# Altium project EXP_V100.PrjPcb
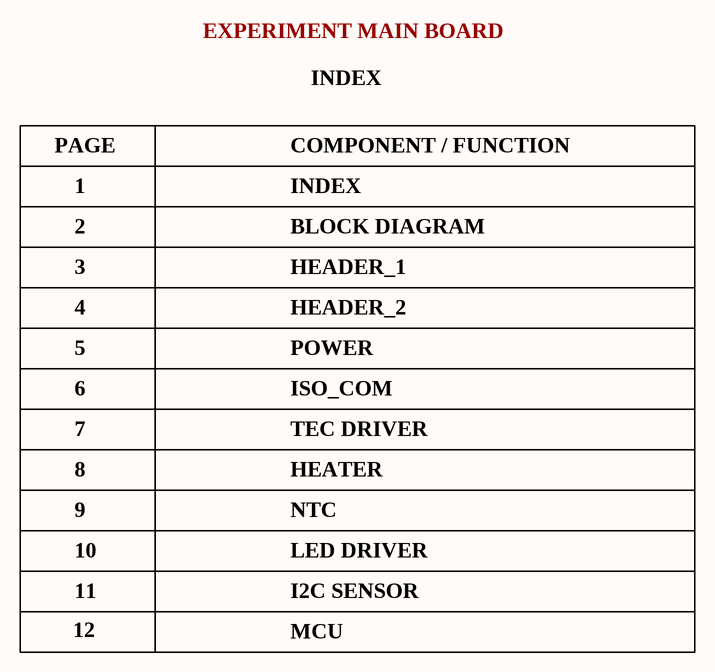
[diagram p0: INDEX.SchDoc]
12 sheets, 357 parts. Net scope: global (net labels, ports and power ports of the same name join across sheets).
Board file: EXP_V101.PcbDoc
Sheets:
  INDEX.SchDoc
  BLOCK_DIAGRAM.SchDoc
  HEADERS_1.SchDoc
  HEADERS_2.SchDoc
  POWERchDoc.SchDoc
  ISO_COM.SchDoc
  TECS_DRIVER.SchDoc
  HEATER.SchDoc
  NTC.SchDoc
  I2C_SENSOR.SchDoc
  LED.SchDoc
  MCU.SchDoc

## Sheet INDEX.SchDoc: INDEX
size 420 x 297 mm; CheckedBy: BAO BUI Q.; Author: SANG HUYNH; DocumentNumber: 1; Revision: V1.0.0; SheetNumber: 2; SheetTotal: 12

### Notes on the sheet
- EXPERIMENT MAIN BOARD
- PAGE
- COMPONENT / FUNCTION
- INDEX
- 1
- 2
- 3
- BLOCK DIAGRAM
- HEADER_1
- 4
- HEADER_2
- 5
- 6
- POWER
- ISO_COM
- 7
- 8
- TEC DRIVER
- HEATER
- 9
- 10
- NTC
- LED DRIVER
- 11
- I2C SENSOR
- 12
- MCU
- Project:
- PEE-PC1
- Sub-system:
- NANORACK_EXP_CONTROLLER
- Design by:
- SANG HUYNH
- BAO BUI Q.
- Sheet title:
- Sheet
- A3
- of
- Checked by:
- Approved by:
- VU PHAM
- Revision:
- Document No:
- V1.0.0
- Size:
- Date:

## Sheet BLOCK_DIAGRAM.SchDoc: BLOCK_DIAGRAM
size 420 x 297 mm; SheetNumber: 2; SheetTotal: 12

### Notes on the sheet
- Project:
- PEE-PC1
- Sub-system:
- NANORACK_EXP_CONTROLLER
- Design by:
- SANG HUYNH
- BAO BUI Q.
- Sheet title:
- Sheet
- A3
- of
- Checked by:
- Approved by:
- VU PHAM
- Revision:
- Document No:
- V1.0.0
- Size:
- Date:
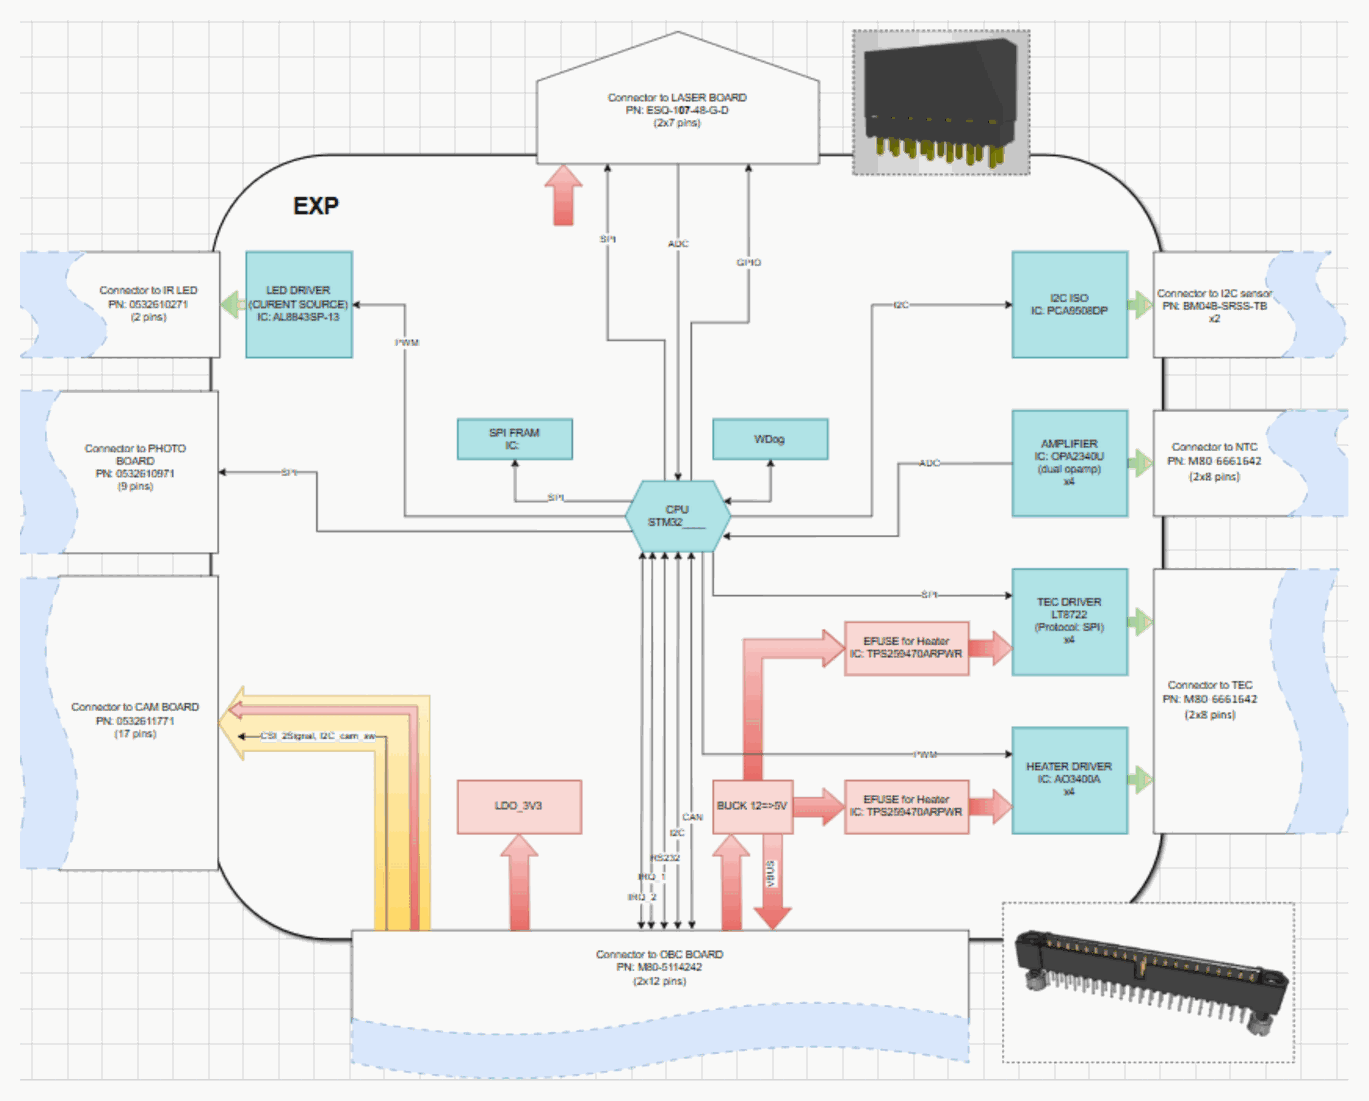
[diagram p1: BLOCK_DIAGRAM.SchDoc]

## Sheet HEADERS_1.SchDoc: HEADER
size 420 x 297 mm; SheetNumber: 3; SheetTotal: 12
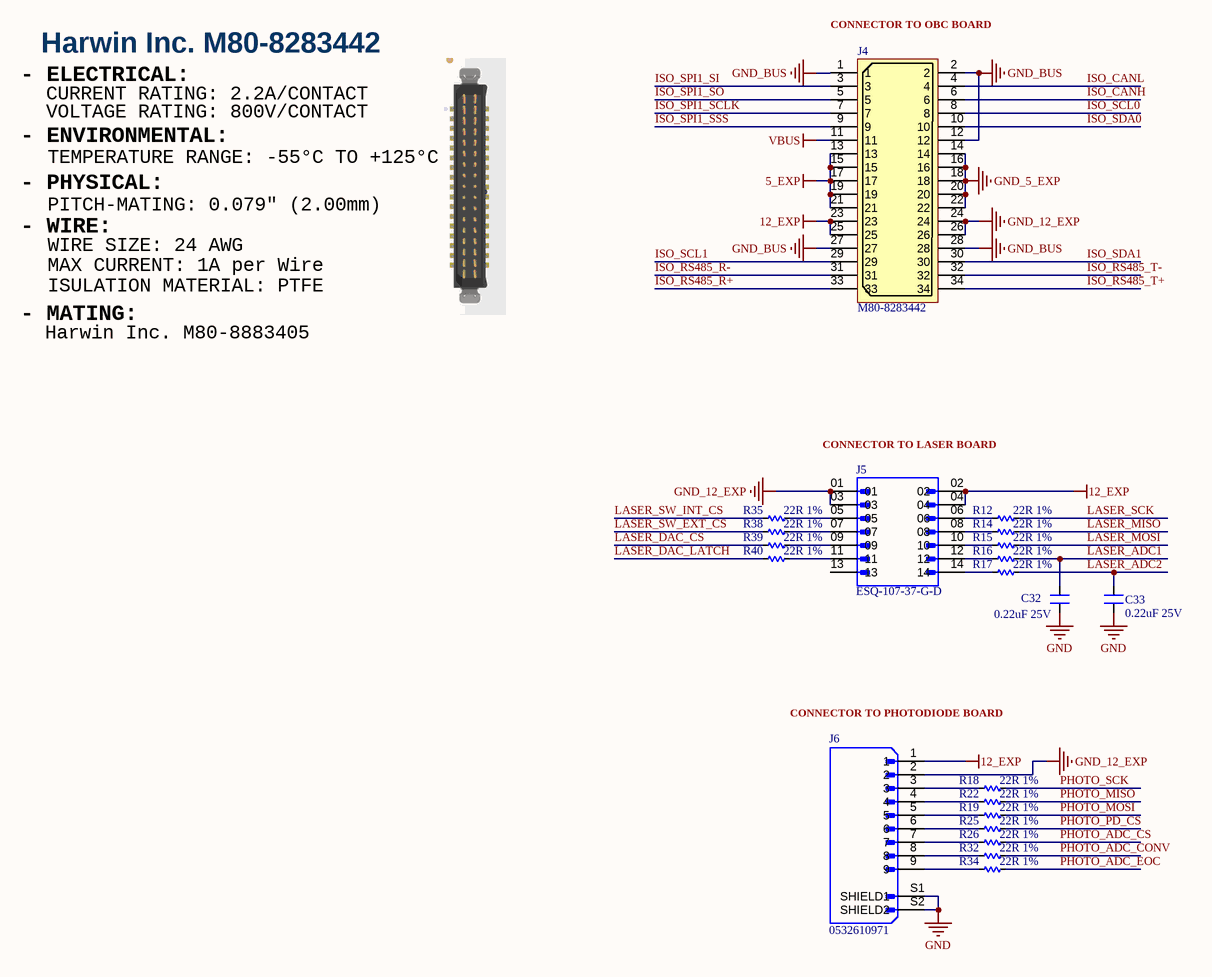
[diagram p2: HEADERS_1.SchDoc]

### Parts
C32  0.22uF 25V  [CN-SMD-0603-EXP-V101]
C33  0.22uF 25V  [CN-SMD-0603-EXP-V101]
J4  M80-8283442  [M80-8283442]
J5  ESQ-107-37-G-D  [ESQ-107-37-G-D]
J6  0532610971  [0532610971]
R12  22R 1%  [RES-SMD-0603-EXP-V101]
R14  22R 1%  [RES-SMD-0603-EXP-V101]
R15  22R 1%  [RES-SMD-0603-EXP-V101]
R16  22R 1%  [RES-SMD-0603-EXP-V101]
R17  22R 1%  [RES-SMD-0603-EXP-V101]
R18  22R 1%  [RES-SMD-0603-EXP-V101]
R19  22R 1%  [RES-SMD-0603-EXP-V101]
R22  22R 1%  [RES-SMD-0603-EXP-V101]
R25  22R 1%  [RES-SMD-0603-EXP-V101]
R26  22R 1%  [RES-SMD-0603-EXP-V101]
R32  22R 1%  [RES-SMD-0603-EXP-V101]
R34  22R 1%  [RES-SMD-0603-EXP-V101]
R35  22R 1%  [RES-SMD-0603-EXP-V101]
R38  22R 1%  [RES-SMD-0603-EXP-V101]
R39  22R 1%  [RES-SMD-0603-EXP-V101]
R40  22R 1%  [RES-SMD-0603-EXP-V101]

### Nets
5_EXP: J4.13 J4.15 J4.17 J4.19 J4.21
12_EXP: J4.23 J4.25 J5.02 J5.04 J6.1
GND: C32.1 C33.1 J4.24 J4.26 J5.01 J5.03 J6.2 J6.S1(SHIELD1) J6.S2(SHIELD2)  [also labelled GND_12_EXP]
GND_5_EXP: J4.14 J4.16 J4.18 J4.20 J4.22
GND_BUS: J4.1 J4.2 J4.12 J4.27 J4.28
VBUS: J4.11
ISO_CANH: J4.6
ISO_CANL: J4.4
ISO_RS485_R+: J4.33
ISO_RS485_R-: J4.31
ISO_RS485_T+: J4.34
ISO_RS485_T-: J4.32
ISO_SCL0: J4.8
ISO_SCL1: J4.29
ISO_SDA0: J4.10
ISO_SDA1: J4.30
ISO_SPI1_~{SSS}: J4.9
ISO_SPI1_SCLK: J4.7
ISO_SPI1_SI: J4.3
ISO_SPI1_SO: J4.5
LASER_ADC1: C32.2 R16.2
LASER_ADC2: C33.2 R17.2
LASER_DAC_CS: R39.1
LASER_DAC_LATCH: R40.1
LASER_MISO: R14.2
LASER_MOSI: R15.2
LASER_SCK: R12.2
LASER_SW_EXT_CS: R38.1
LASER_SW_INT_CS: R35.1
PHOTO_ADC_CONV: R32.2
PHOTO_ADC_CS: R26.2
PHOTO_ADC_EOC: R34.2
PHOTO_MISO: R22.2
PHOTO_MOSI: R19.2
PHOTO_PD_CS: R25.2
PHOTO_SCK: R18.2
NetJ5_05: J5.05 R35.2
NetJ5_06: J5.06 R12.1
NetJ5_07: J5.07 R38.2
NetJ5_08: J5.08 R14.1
NetJ5_09: J5.09 R39.2
NetJ5_10: J5.10 R15.1
NetJ5_11: J5.11 R40.2
NetJ5_12: J5.12 R16.1
NetJ5_14: J5.14 R17.1
NetJ6_3: J6.3 R18.1
NetJ6_4: J6.4 R22.1
NetJ6_5: J6.5 R19.1
NetJ6_6: J6.6 R25.1
NetJ6_7: J6.7 R26.1
NetJ6_8: J6.8 R32.1
NetJ6_9: J6.9 R34.1

Not connected (* = marked no-connect by the designer): J5 13

### Notes on the sheet
- (near J4) CONNECTOR TO OBC BOARD
- - ELECTRICAL:
- Harwin Inc. M80-8283442
- CURRENT RATING: 2.2A/CONTACT
- - ENVIRONMENTAL:
- VOLTAGE RATING: 800V/CONTACT
- TEMPERATURE RANGE: -55°C TO +125°C
- - PHYSICAL:
- - WIRE:
- PITCH-MATING: 0.079" (2.00mm)
- WIRE SIZE: 24 AWG
- MAX CURRENT: 1A per Wire
- ISULATION MATERIAL: PTFE
- - MATING:
- Harwin Inc. M80-8883405
- (near J5) CONNECTOR TO LASER BOARD
- (near J6) CONNECTOR TO PHOTODIODE BOARD
- Project:
- PEE-PC1
- Sub-system:
- NANORACK_EXP_CONTROLLER
- Design by:
- SANG HUYNH
- BAO BUI Q.
- Sheet title:
- Sheet
- A3
- of
- Checked by:
- Approved by:
- VU PHAM
- Revision:
- Document No:
- V1.0.0
- Size:
- Date:

### Library data of the parts
C32 C33 = Capacitors: Value: 33pF
J4 = M80-8283442: CONN HEADER SMD 34POS 2MM
J5 = CONN_TH_14: CONN SOCKET 14POS 0.1 GOLD PCB
J6 = CONN_SMD_09: CONN HEADER SMD R/A 9POS 1.25MM
R12 R14-R19 R22 R25 R26 R32 R34 R35 R38-R40 = Res SMD: SMD; Manufacturer: Generic Components; Class: Passive; Published: 08/06/2000; Publisher: Altium Hobart Technology Centre

## Sheet HEADERS_2.SchDoc
size 420 x 297 mm; SheetNumber: 4; SheetTotal: 12
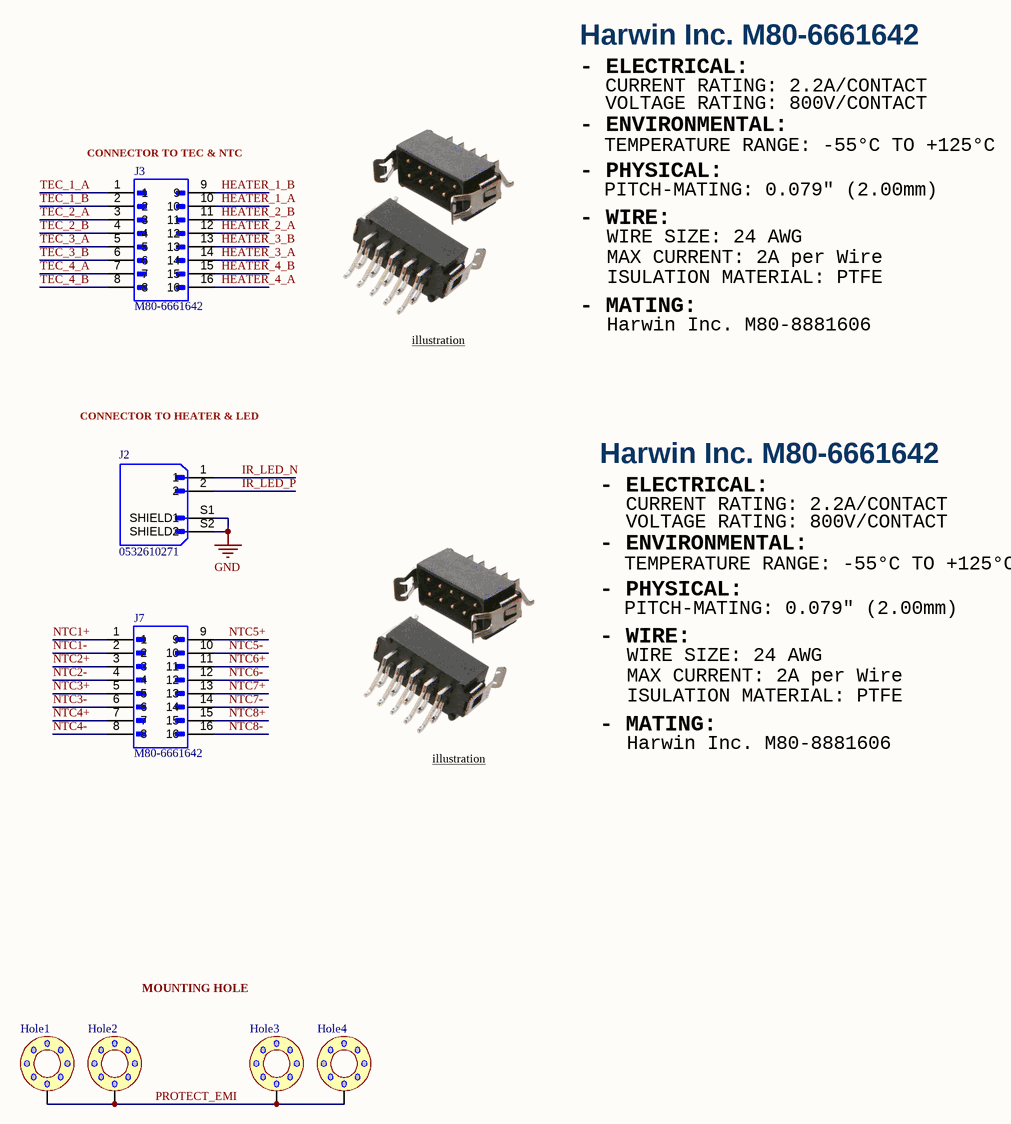
[diagram p3: HEADERS_2.SchDoc]

### Parts
Hole1  hole_space  [HOLE_SPACE]  (value not drawn)
Hole2  hole_space  [HOLE_SPACE]  (value not drawn)
Hole3  hole_space  [HOLE_SPACE]  (value not drawn)
Hole4  hole_space  [HOLE_SPACE]  (value not drawn)
J2  0532610271  [0532610271]
J3  M80-6661642  [M80-6661642]
J7  M80-6661642  [M80-6661642]

### Nets
GND: J2.S1(SHIELD1) J2.S2(SHIELD2)
HEATER_1_A: J3.10 J3.12 J3.14 J3.16  [also labelled HEATER_2_A, HEATER_3_A, HEATER_4_A]
NTC1+: J7.1 J7.3 J7.5 J7.7 J7.9 J7.11 J7.13 J7.15  [also labelled NTC2+, NTC3+, NTC4+, NTC5+, NTC6+, NTC7+, NTC8+]  [project net 3V3_EXP]
HEATER_1_B: J3.9
HEATER_2_B: J3.11
HEATER_3_B: J3.13
HEATER_4_B: J3.15
IR_LED_N: J2.1
IR_LED_P: J2.2
NTC1-: J7.2
NTC2-: J7.4
NTC3-: J7.6
NTC4-: J7.8
NTC5-: J7.10
NTC6-: J7.12
NTC7-: J7.14
NTC8-: J7.16
PROTECT_EMI: Hole1.1 Hole2.1 Hole3.1 Hole4.1
TEC_1_A: J3.1
TEC_1_B: J3.2
TEC_2_A: J3.3
TEC_2_B: J3.4
TEC_3_A: J3.5
TEC_3_B: J3.6
TEC_4_A: J3.7
TEC_4_B: J3.8

### Notes on the sheet
- Harwin Inc. M80-6661642
- - ELECTRICAL:
- CURRENT RATING: 2.2A/CONTACT
- VOLTAGE RATING: 800V/CONTACT
- (near J3) CONNECTOR TO TEC & NTC
- - ENVIRONMENTAL:
- - PHYSICAL:
- TEMPERATURE RANGE: -55°C TO +125°C
- - WIRE:
- PITCH-MATING: 0.079" (2.00mm)
- WIRE SIZE: 24 AWG
- - MATING:
- MAX CURRENT: 2A per Wire
- ISULATION MATERIAL: PTFE
- illustration
- Harwin Inc. M80-8881606
- CONNECTOR TO HEATER & LED
- Labels drawn without touching a wire or pin: MOUNTING HOLE
- Project:
- PEE-PC1
- Sub-system:
- NANORACK_EXP_CONTROLLER
- Design by:
- SANG HUYNH
- BAO BUI Q.
- Sheet title:
- Sheet
- A3
- of
- Checked by:
- Approved by:
- VU PHAM
- Revision:
- Document No:
- V1.0.0
- Size:
- Date:

### Library data of the parts
J2 = CONN_SMD_02: CONN HEADER SMD R/A 2POS 1.25MM
J3 J7 = CONN_SMD_16: CONN HEADER SMD R/A 16POS 2MM

## Sheet POWERchDoc.SchDoc: POWER
size 420 x 297 mm; SheetNumber: 5; SheetTotal: 12
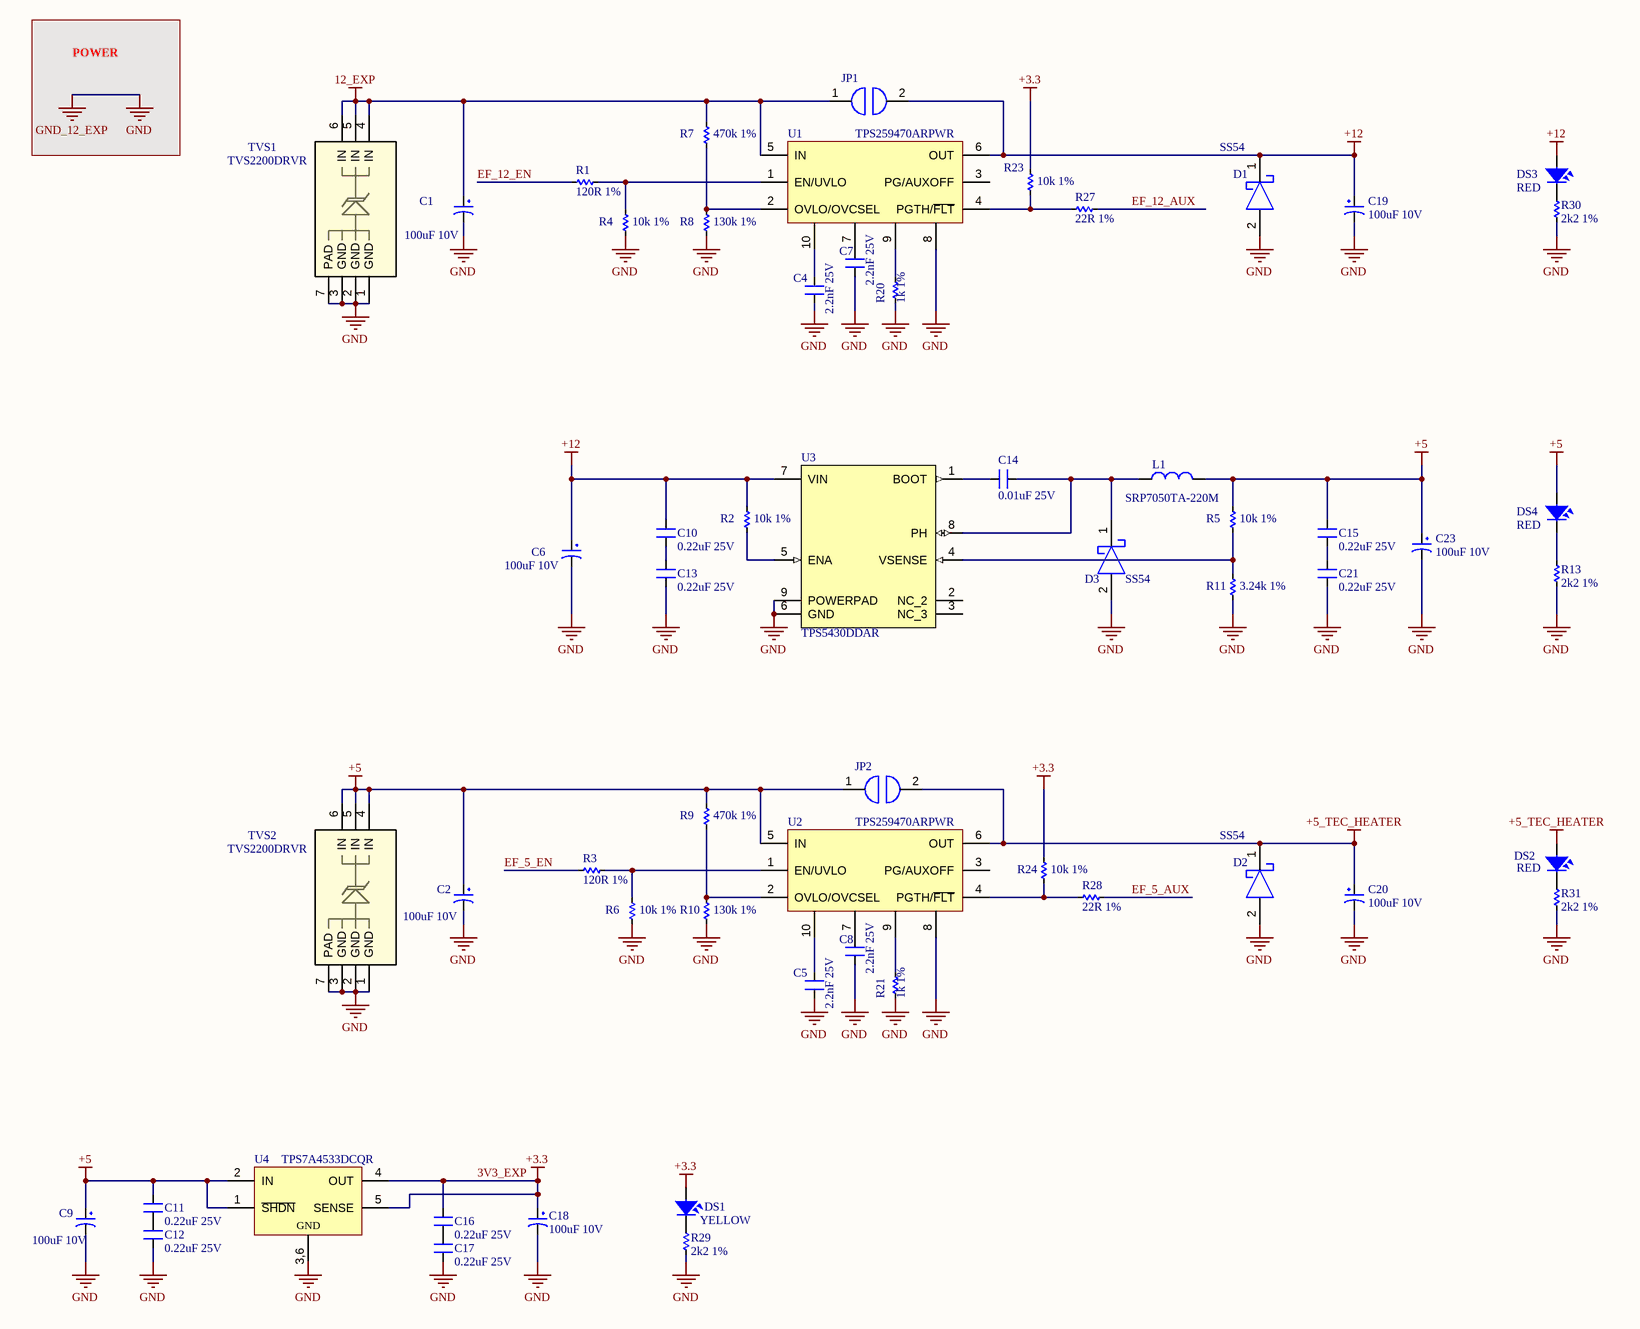
[diagram p4: POWERchDoc.SchDoc]

### Parts
C1  100uF 10V  [TANTALUM-SMD-1206-EXP-V101]
C2  100uF 10V  [TANTALUM-SMD-1206-EXP-V101]
C4  2.2nF 25V  [CN-SMD-0603-EXP-V101]
C5  2.2nF 25V  [CN-SMD-0603-EXP-V101]
C6  100uF 10V  [TANTALUM-SMD-1206-EXP-V101]
C7  2.2nF 25V  [CN-SMD-0603-EXP-V101]
C8  2.2nF 25V  [CN-SMD-0603-EXP-V101]
C9  100uF 10V  [TANTALUM-SMD-1206-EXP-V101]
C10  0.22uF 25V  [CN-SMD-0603-EXP-V101]
C11  0.22uF 25V  [CN-SMD-0603-EXP-V101]
C12  0.22uF 25V  [CN-SMD-0603-EXP-V101]
C13  0.22uF 25V  [CN-SMD-0603-EXP-V101]
C14  0.01uF 25V  [CN-SMD-0603-EXP-V101]
C15  0.22uF 25V  [CN-SMD-0603-EXP-V101]
C16  0.22uF 25V  [CN-SMD-0603-EXP-V101]
C17  0.22uF 25V  [CN-SMD-0603-EXP-V101]
C18  100uF 10V  [TANTALUM-SMD-1206-EXP-V101]
C19  100uF 10V  [TANTALUM-SMD-1206-EXP-V101]
C20  100uF 10V  [TANTALUM-SMD-1206-EXP-V101]
C21  0.22uF 25V  [CN-SMD-0603-EXP-V101]
C23  100uF 10V  [TANTALUM-SMD-1206-EXP-V101]
D1  SS54  [DO214-AC-SMA]
D2  SS54  [DO214-AC-SMA]
D3  SS54  [DO214-AC-SMA]
DS1  YELLOW  [LED-0603-BLUE-EXP-V01]
DS2  RED  [LED-0603-BLUE-EXP-V01]
DS3  RED  [LED-0603-BLUE-EXP-V01]
DS4  RED  [LED-0603-BLUE-EXP-V01]
JP1  jumper2  [JUMPER-EXP-V101]  (value not drawn)
JP2  jumper2  [JUMPER-EXP-V101]  (value not drawn)
L1  SRP7050TA-220M  [PSM6050]
R1  120R 1%  [RES-SMD-0603-EXP-V101]
R2  10k 1%  [RES-SMD-0603-EXP-V101]
R3  120R 1%  [RES-SMD-0603-EXP-V101]
R4  10k 1%  [RES-SMD-0603-EXP-V101]
R5  10k 1%  [RES-SMD-0603-EXP-V101]
R6  10k 1%  [RES-SMD-0603-EXP-V101]
R7  470k 1%  [RES-SMD-0603-EXP-V101]
R8  130k 1%  [RES-SMD-0603-EXP-V101]
R9  470k 1%  [RES-SMD-0603-EXP-V101]
R10  130k 1%  [RES-SMD-0603-EXP-V101]
R11  3.24k 1%  [RES-SMD-0603-EXP-V101]
R13  2k2 1%  [RES-SMD-0603-EXP-V101]
R20  1k 1%  [RES-SMD-0603-EXP-V101]
R21  1k 1%  [RES-SMD-0603-EXP-V101]
R23  10k 1%  [RES-SMD-0603-EXP-V101]
R24  10k 1%  [RES-SMD-0603-EXP-V101]
R27  22R 1%  [RES-SMD-0603-EXP-V101]
R28  22R 1%  [RES-SMD-0603-EXP-V101]
R29  2k2 1%  [RES-SMD-0603-EXP-V101]
R30  2k2 1%  [RES-SMD-0603-EXP-V101]
R31  2k2 1%  [RES-SMD-0603-EXP-V101]
TVS1  TVS2200DRVR  [TVS2200]
TVS2  TVS2200DRVR  [TVS2200]
U1  TPS259470ARPWR  [VQFN-HR-10-EXP-V101]
U2  TPS259470ARPWR  [VQFN-HR-10-EXP-V101]
U3  TPS5430DDAR  [TPS5430DDAR]
U4  TPS7A4533DCQR  [SOT223_6]

### Nets
3V3_EXP: C16.2 C18.1 DS1.1 R23.1 R24.1 U4.4(OUT) U4.5(SENSE)  [also labelled +3.3]
12_EXP: C1.1 JP1.1 R7.1 TVS1.4(IN) TVS1.5(IN) TVS1.6(IN) U1.5(IN)
+5: C2.1 C9.1 C11.2 C15.2 C23.1 DS4.1 JP2.1 L1.2 R5.1 R9.1 TVS2.4(IN) TVS2.5(IN) TVS2.6(IN) U2.5(IN) U4.1(~{SHDN}) U4.2(IN)
+5_TEC_HEATER: C20.1 D2.1 DS2.1 JP2.2 U2.6(OUT)  [project net HEATER_1_A]
+12: C6.1 C10.2 C19.1 D1.1 DS3.1 JP1.2 R2.1 U1.6(OUT) U3.7(VIN)
GND: C1.2 C2.2 C4.1 C5.1 C6.2 C7.1 C8.1 C9.2 C12.1 C13.1 C17.1 C18.2 C19.2 C20.2 C21.1 C23.2 D1.2 D2.2 D3.2 R4.2 R6.2 R8.2 R10.2 R11.2 R13.2 R20.2 R21.2 R29.2 R30.2 R31.2 TVS1.1(GND) TVS1.2(GND) TVS1.3(GND) TVS1.7(PAD) TVS2.1(GND) TVS2.2(GND) TVS2.3(GND) TVS2.7(PAD) U1.8 U2.8 U3.6(GND) U3.9(POWERPAD) U4.3,6(GND)  [also labelled GND_12_EXP]
EF_5_AUX: R28.2
EF_5_EN: R3.1
EF_12_AUX: R27.2
EF_12_EN: R1.1
NetC4_2: C4.2 U1.10
NetC5_2: C5.2 U2.10
NetC7_2: C7.2 U1.7
NetC8_2: C8.2 U2.7
NetC10_1: C10.1 C13.2
NetC11_1: C11.1 C12.2
NetC14_1: C14.1 D3.1 L1.1 U3.8(PH)
NetC14_2: C14.2 U3.1(BOOT)
NetC15_1: C15.1 C21.2
NetC16_1: C16.1 C17.2
NetDS1_2: DS1.2 R29.1
NetDS2_2: DS2.2 R31.1
NetDS3_2: DS3.2 R30.1
NetDS4_2: DS4.2 R13.1
NetR1_2: R1.2 R4.1 U1.1(EN/UVLO)
NetR2_2: R2.2 U3.5(ENA)
NetR3_2: R3.2 R6.1 U2.1(EN/UVLO)
NetR5_2: R5.2 R11.1 U3.4(VSENSE)
NetR7_2: R7.2 R8.1 U1.2(OVLO/OVCSEL)
NetR9_2: R9.2 R10.1 U2.2(OVLO/OVCSEL)
NetR20_1: R20.1 U1.9
NetR21_1: R21.1 U2.9
NetR23_2: R23.2 R27.1 U1.4(PGTH/~{FLT})
NetR24_2: R24.2 R28.1 U2.4(PGTH/~{FLT})

Not connected (* = marked no-connect by the designer): U1 3(PG/AUXOFF); U2 3(PG/AUXOFF); U3 2(NC_2) 3(NC_3)

### Notes on the sheet
- POWER
- Project:
- PEE-PC1
- Sub-system:
- NANORACK_EXP_CONTROLLER
- Design by:
- SANG HUYNH
- BAO BUI Q.
- Sheet title:
- Sheet
- A3
- of
- Checked by:
- Approved by:
- VU PHAM
- Revision:
- Document No:
- V1.0.0
- Size:
- Date:

### Library data of the parts
C1 C2 C6 C9 C18-C20 C23 = Cap_Tantalum SMD: SMD; Chung_Loai: Dán; Don_Vi: Con; So_Chan: 2; Ten_Linh_Kien: Tụ tantalum 477A-470uF 10V SMD7343; Ma_Hang: MH001956; Kieu_Chan: *
C4 C5 C7 C8 C10-C17 C21 = Capacitors: Value: 33pF
D1-D3 = B360B-E3/52T: DIODE SCHOTTKY 40V 5A SMA
DS1-DS4 = LED SMD: Value: LED 3 - 5 ly 2 Colour
JP1 JP2 = JUMPER
L1 = SRP7050TA-220M: FIXED IND 22UH 2.5A 170 MOHM SMD
R1-R11 R13 R20 R21 R23 R24 R27-R31 = Res SMD: as R12 on sheet HEADERS_1; Published: 08/06/2000; Publisher: Altium Hobart Technology Centre
TVS1 TVS2 = TVS2200: UNIDIR PRECISION SURGE DIODE
U3 = TPS5430: IC REG BUCK ADJ 3A 8SOPWR
U4 = TPS7A4533DCQR: IC REG LINEAR 3.3V 1.5A SOT223-6

## Sheet ISO_COM.SchDoc: ISO_COMMUNICATION
size 420 x 297 mm; SheetNumber: 6; SheetTotal: 12
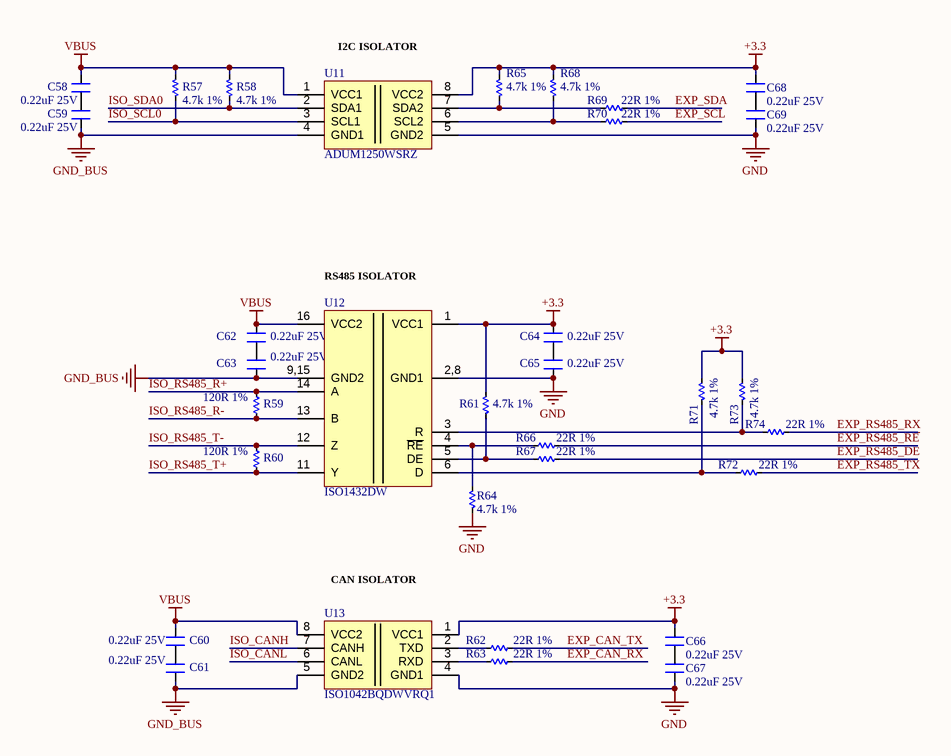
[diagram p5: ISO_COM.SchDoc]

### Parts
C58  0.22uF 25V  [CN-SMD-0603-EXP-V101]
C59  0.22uF 25V  [CN-SMD-0603-EXP-V101]
C60  0.22uF 25V  [CN-SMD-0603-EXP-V101]
C61  0.22uF 25V  [CN-SMD-0603-EXP-V101]
C62  0.22uF 25V  [CN-SMD-0603-EXP-V101]
C63  0.22uF 25V  [CN-SMD-0603-EXP-V101]
C64  0.22uF 25V  [CN-SMD-0603-EXP-V101]
C65  0.22uF 25V  [CN-SMD-0603-EXP-V101]
C66  0.22uF 25V  [CN-SMD-0603-EXP-V101]
C67  0.22uF 25V  [CN-SMD-0603-EXP-V101]
C68  0.22uF 25V  [CN-SMD-0603-EXP-V101]
C69  0.22uF 25V  [CN-SMD-0603-EXP-V101]
R57  4.7k 1%  [RES-SMD-0603-EXP-V101]
R58  4.7k 1%  [RES-SMD-0603-EXP-V101]
R59  120R 1%  [RES-SMD-0603-EXP-V101]
R60  120R 1%  [RES-SMD-0603-EXP-V101]
R61  4.7k 1%  [RES-SMD-0603-EXP-V101]
R62  22R 1%  [RES-SMD-0603-EXP-V101]
R63  22R 1%  [RES-SMD-0603-EXP-V101]
R64  4.7k 1%  [RES-SMD-0603-EXP-V101]
R65  4.7k 1%  [RES-SMD-0603-EXP-V101]
R66  22R 1%  [RES-SMD-0603-EXP-V101]
R67  22R 1%  [RES-SMD-0603-EXP-V101]
R68  4.7k 1%  [RES-SMD-0603-EXP-V101]
R69  22R 1%  [RES-SMD-0603-EXP-V101]
R70  22R 1%  [RES-SMD-0603-EXP-V101]
R71  4.7k 1%  [RES-SMD-0603-EXP-V101]
R72  22R 1%  [RES-SMD-0603-EXP-V101]
R73  4.7k 1%  [RES-SMD-0603-EXP-V101]
R74  22R 1%  [RES-SMD-0603-EXP-V101]
U11  ADUM1250WSRZ  [SOIC-8]
U12  ISO1432DW  [ISO1432DW]
U13  ISO1042BQDWVRQ1  [ISO1042]

### Nets
+3.3: C64.2 C66.2 C68.2 R61.2 R65.2 R68.2 R71.2 R73.2 U11.8(VCC2) U12.1(VCC1) U13.1(VCC1)  [project net 3V3_EXP]
GND: C65.1 C67.1 C69.1 R64.2 U11.5(GND2) U12.2,8(GND1) U13.4(GND1)
GND_BUS: C59.1 C61.1 C63.1 U11.4(GND1) U12.9,15(GND2) U13.5(GND2)
VBUS: C58.2 C60.2 C62.2 R57.2 R58.2 U11.1(VCC1) U12.16(VCC2) U13.8(VCC2)
EXP_CAN_RX: R63.2
EXP_CAN_TX: R62.2
EXP_RS485_DE: R67.2
EXP_RS485_~{RE}: R66.2
EXP_RS485_RX: R74.2
EXP_RS485_TX: R72.2
EXP_SCL: R70.2
EXP_SDA: R69.2
ISO_CANH: U13.7(CANH)
ISO_CANL: U13.6(CANL)
ISO_RS485_R+: R59.2 U12.14(A)
ISO_RS485_R-: R59.1 U12.13(B)
ISO_RS485_T+: R60.1 U12.11(Y)
ISO_RS485_T-: R60.2 U12.12(Z)
ISO_SCL0: R57.1 U11.3(SCL1)
ISO_SDA0: R58.1 U11.2(SDA1)
NetC58_1: C58.1 C59.2
NetC60_1: C60.1 C61.2
NetC62_1: C62.1 C63.2
NetC64_1: C64.1 C65.2
NetC66_1: C66.1 C67.2
NetC68_1: C68.1 C69.2
NetR61_1: R61.1 R67.1 U12.5(DE)
NetR62_1: R62.1 U13.2(TXD)
NetR63_1: R63.1 U13.3(RXD)
NetR64_1: R64.1 R66.1 U12.4(~{RE})
NetR65_1: R65.1 R69.1 U11.7(SDA2)
NetR68_1: R68.1 R70.1 U11.6(SCL2)
NetR71_1: R71.1 R72.1 U12.6(D)
NetR73_1: R73.1 R74.1 U12.3(R)

### Notes on the sheet
- (near U11) I2C ISOLATOR
- (near U12) RS485 ISOLATOR
- (near U13) CAN ISOLATOR
- Project:
- PEE-PC1
- Sub-system:
- NANORACK_EXP_CONTROLLER
- Design by:
- SANG HUYNH
- BAO BUI Q.
- Sheet title:
- Sheet
- A3
- of
- Checked by:
- Approved by:
- VU PHAM
- Revision:
- Document No:
- V1.0.0
- Size:
- Date:

### Library data of the parts
C58-C69 = Capacitors: Value: 33pF
R57-R74 = Res SMD: as R12 on sheet HEADERS_1; Published: 08/06/2000; Publisher: Altium Hobart Technology Centre
U11 = ADUM1250
U12 = ISO1432DW: IC TRANSCEIVER FULL 1/1 16SOIC
U13 = ISO1042: IC TRANSCEIVER FULL 1/1 8SOIC

## Sheet TECS_DRIVER.SchDoc: TEC_DRIVER
size 420 x 297 mm; SheetNumber: 7; SheetTotal: 12
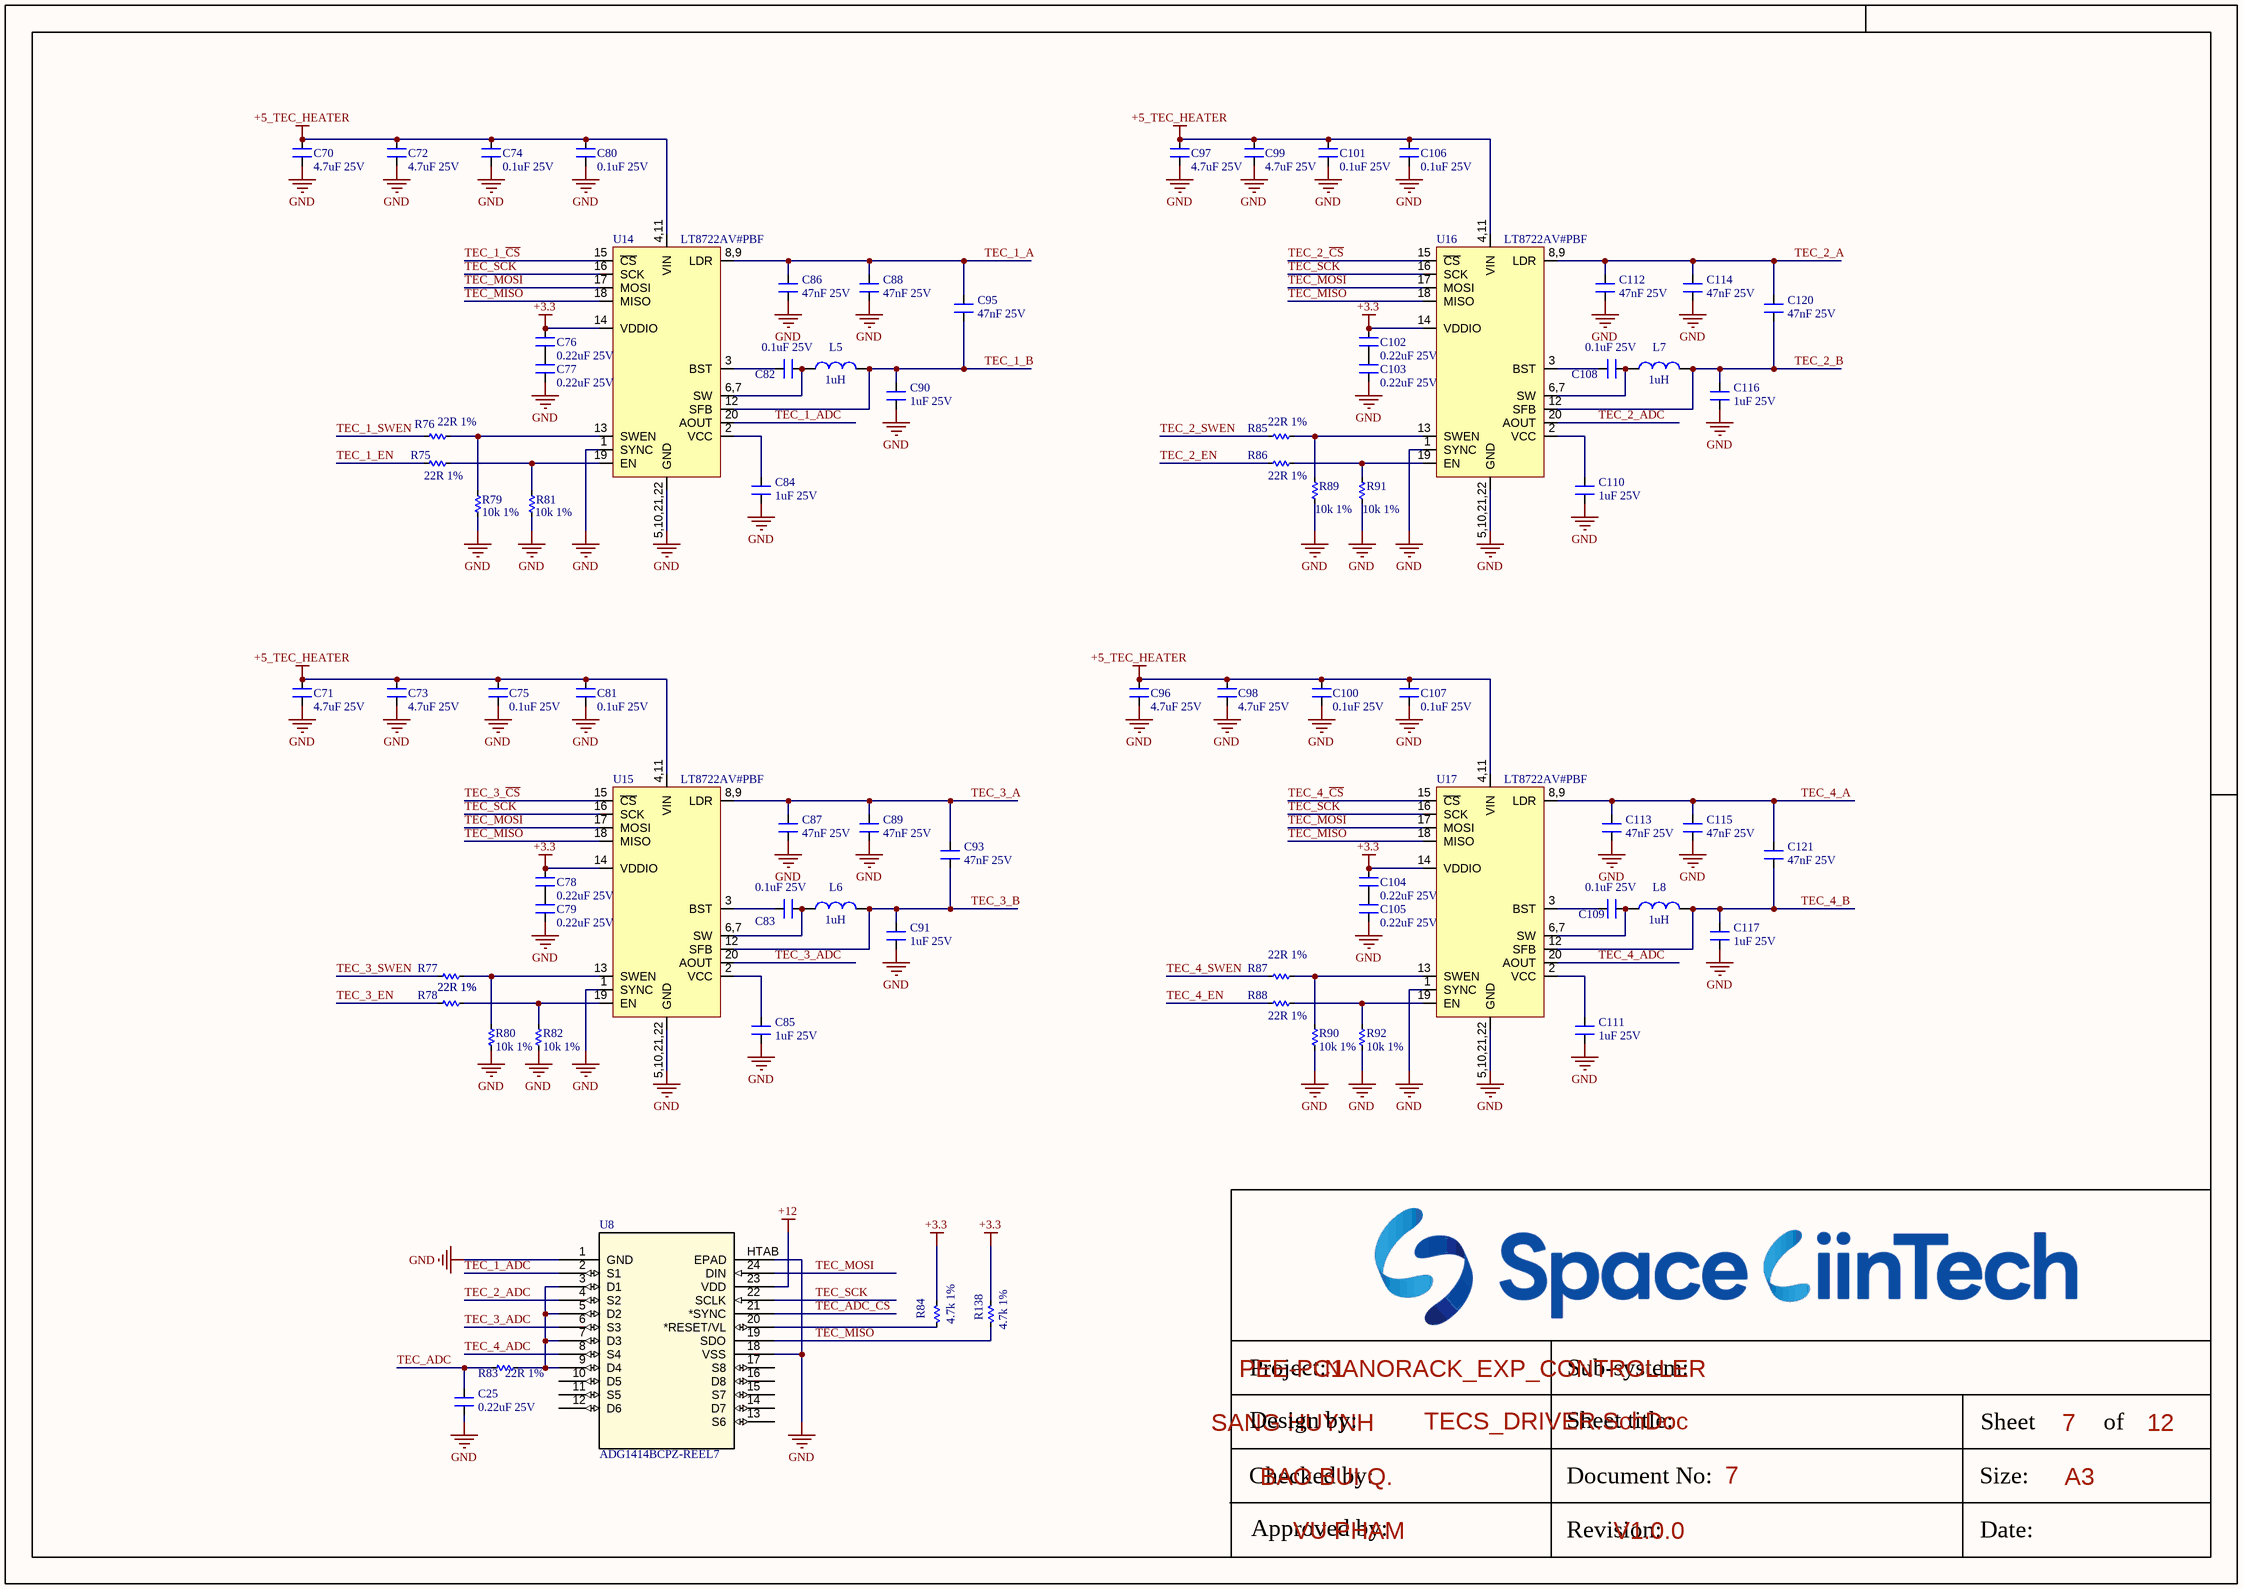
[diagram p6: TECS_DRIVER.SchDoc]

### Parts
C25  0.22uF 25V  [CN-SMD-0603-EXP-V101]
C70  4.7uF 25V  [CN-SMD-0603-EXP-V101]
C71  4.7uF 25V  [CN-SMD-0603-EXP-V101]
C72  4.7uF 25V  [CN-SMD-0603-EXP-V101]
C73  4.7uF 25V  [CN-SMD-0603-EXP-V101]
C74  0.1uF 25V  [CN-SMD-0603-EXP-V101]
C75  0.1uF 25V  [CN-SMD-0603-EXP-V101]
C76  0.22uF 25V  [CN-SMD-0603-EXP-V101]
C77  0.22uF 25V  [CN-SMD-0603-EXP-V101]
C78  0.22uF 25V  [CN-SMD-0603-EXP-V101]
C79  0.22uF 25V  [CN-SMD-0603-EXP-V101]
C80  0.1uF 25V  [CN-SMD-0603-EXP-V101]
C81  0.1uF 25V  [CN-SMD-0603-EXP-V101]
C82  0.1uF 25V  [CN-SMD-0603-EXP-V101]
C83  0.1uF 25V  [CN-SMD-0603-EXP-V101]
C84  1uF 25V  [CN-SMD-0603-EXP-V101]
C85  1uF 25V  [CN-SMD-0603-EXP-V101]
C86  47nF 25V  [CN-SMD-0603-EXP-V101]
C87  47nF 25V  [CN-SMD-0603-EXP-V101]
C88  47nF 25V  [CN-SMD-0603-EXP-V101]
C89  47nF 25V  [CN-SMD-0603-EXP-V101]
C90  1uF 25V  [CN-SMD-0603-EXP-V101]
C91  1uF 25V  [CN-SMD-0603-EXP-V101]
C93  47nF 25V  [CN-SMD-0603-EXP-V101]
C95  47nF 25V  [CN-SMD-0603-EXP-V101]
C96  4.7uF 25V  [CN-SMD-0603-EXP-V101]
C97  4.7uF 25V  [CN-SMD-0603-EXP-V101]
C98  4.7uF 25V  [CN-SMD-0603-EXP-V101]
C99  4.7uF 25V  [CN-SMD-0603-EXP-V101]
C100  0.1uF 25V  [CN-SMD-0603-EXP-V101]
C101  0.1uF 25V  [CN-SMD-0603-EXP-V101]
C102  0.22uF 25V  [CN-SMD-0603-EXP-V101]
C103  0.22uF 25V  [CN-SMD-0603-EXP-V101]
C104  0.22uF 25V  [CN-SMD-0603-EXP-V101]
C105  0.22uF 25V  [CN-SMD-0603-EXP-V101]
C106  0.1uF 25V  [CN-SMD-0603-EXP-V101]
C107  0.1uF 25V  [CN-SMD-0603-EXP-V101]
C108  0.1uF 25V  [CN-SMD-0603-EXP-V101]
C109  0.1uF 25V  [CN-SMD-0603-EXP-V101]
C110  1uF 25V  [CN-SMD-0603-EXP-V101]
C111  1uF 25V  [CN-SMD-0603-EXP-V101]
C112  47nF 25V  [CN-SMD-0603-EXP-V101]
C113  47nF 25V  [CN-SMD-0603-EXP-V101]
C114  47nF 25V  [CN-SMD-0603-EXP-V101]
C115  47nF 25V  [CN-SMD-0603-EXP-V101]
C116  1uF 25V  [CN-SMD-0603-EXP-V101]
C117  1uF 25V  [CN-SMD-0603-EXP-V101]
C120  47nF 25V  [CN-SMD-0603-EXP-V101]
C121  47nF 25V  [CN-SMD-0603-EXP-V101]
L5  1uH  [L-SMD-M-3.5x3.5x2mm-EXP-V101]
L6  1uH  [L-SMD-M-3.5x3.5x2mm-EXP-V101]
L7  1uH  [L-SMD-M-3.5x3.5x2mm-EXP-V101]
L8  1uH  [L-SMD-M-3.5x3.5x2mm-EXP-V101]
R75  22R 1%  [RES-SMD-0603-EXP-V101]
R76  22R 1%  [RES-SMD-0603-EXP-V101]
R77  22R 1%  [RES-SMD-0603-EXP-V101]
R78  22R 1%  [RES-SMD-0603-EXP-V101]
R79  10k 1%  [RES-SMD-0603-EXP-V101]
R80  10k 1%  [RES-SMD-0603-EXP-V101]
R81  10k 1%  [RES-SMD-0603-EXP-V101]
R82  10k 1%  [RES-SMD-0603-EXP-V101]
R83  22R 1%  [RES-SMD-0603-EXP-V101]
R84  4.7k 1%  [RES-SMD-0603-EXP-V101]
R85  22R 1%  [RES-SMD-0603-EXP-V101]
R86  22R 1%  [RES-SMD-0603-EXP-V101]
R87  22R 1%  [RES-SMD-0603-EXP-V101]
R88  22R 1%  [RES-SMD-0603-EXP-V101]
R89  10k 1%  [RES-SMD-0603-EXP-V101]
R90  10k 1%  [RES-SMD-0603-EXP-V101]
R91  10k 1%  [RES-SMD-0603-EXP-V101]
R92  10k 1%  [RES-SMD-0603-EXP-V101]
R138  4.7k 1%  [RES-SMD-0603-EXP-V101]
U8  ADG1414BCPZ-REEL7  [ADG1414BCPZ-REEL7]
U14  LT8722AV#PBF  [QFN18-EXP-V101]
U15  LT8722AV#PBF  [QFN18-EXP-V101]
U16  LT8722AV#PBF  [QFN18-EXP-V101]
U17  LT8722AV#PBF  [QFN18-EXP-V101]

### Nets
+3.3: C76.2 C78.2 C102.2 C104.2 R84.2 R138.2 U14.14(VDDIO) U15.14(VDDIO) U16.14(VDDIO) U17.14(VDDIO)  [project net 3V3_EXP]
+5_TEC_HEATER: C70.2 C71.2 C72.2 C73.2 C74.2 C75.2 C80.2 C81.2 C96.2 C97.2 C98.2 C99.2 C100.2 C101.2 C106.2 C107.2 U14.4,11(VIN) U15.4,11(VIN) U16.4,11(VIN) U17.4,11(VIN)  [project net HEATER_1_A]
+12: U8.23(VDD)
GND: C25.1 C70.1 C71.1 C72.1 C73.1 C74.1 C75.1 C77.1 C79.1 C80.1 C81.1 C84.1 C85.1 C86.1 C87.1 C88.1 C89.1 C90.1 C91.1 C96.1 C97.1 C98.1 C99.1 C100.1 C101.1 C103.1 C105.1 C106.1 C107.1 C110.1 C111.1 C112.1 C113.1 C114.1 C115.1 C116.1 C117.1 R79.2 R80.1 R81.2 R82.1 R89.2 R90.1 R91.2 R92.1 U8.1(GND) U8.18(VSS) U8.HTAB(EPAD) U14.1(SYNC) U14.5,10,21,22(GND) U15.1(SYNC) U15.5,10,21,22(GND) U16.1(SYNC) U16.5,10,21,22(GND) U17.1(SYNC) U17.5,10,21,22(GND)
TEC_1_A: C86.2 C88.2 C95.2 U14.8,9(LDR)
TEC_1_ADC: U8.2(S1) U14.20(AOUT)
TEC_1_B: C90.2 C95.1 L5.2 U14.12(SFB)
TEC_1_~{CS}: U14.15(~{CS})
TEC_1_EN: R75.1
TEC_1_SWEN: R76.1
TEC_2_A: C112.2 C114.2 C120.2 U16.8,9(LDR)
TEC_2_ADC: U8.4(S2) U16.20(AOUT)
TEC_2_B: C116.2 C120.1 L7.2 U16.12(SFB)
TEC_2_~{CS}: U16.15(~{CS})
TEC_2_EN: R86.1
TEC_2_SWEN: R85.1
TEC_3_A: C87.2 C89.2 C93.2 U15.8,9(LDR)
TEC_3_ADC: U8.6(S3) U15.20(AOUT)
TEC_3_B: C91.2 C93.1 L6.2 U15.12(SFB)
TEC_3_~{CS}: U15.15(~{CS})
TEC_3_EN: R78.1
TEC_3_SWEN: R77.1
TEC_4_A: C113.2 C115.2 C121.2 U17.8,9(LDR)
TEC_4_ADC: U8.8(S4) U17.20(AOUT)
TEC_4_B: C117.2 C121.1 L8.2 U17.12(SFB)
TEC_4_~{CS}: U17.15(~{CS})
TEC_4_EN: R88.1
TEC_4_SWEN: R87.1
TEC_ADC: C25.2 R83.1
TEC_ADC_~{CS}: U8.21(*SYNC)
TEC_MISO: R138.1 U8.19(SDO) U14.18(MISO) U15.18(MISO) U16.18(MISO) U17.18(MISO)
TEC_MOSI: U8.24(DIN) U14.17(MOSI) U15.17(MOSI) U16.17(MOSI) U17.17(MOSI)
TEC_SCK: U8.22(SCLK) U14.16(SCK) U15.16(SCK) U16.16(SCK) U17.16(SCK)
NetC76_1: C76.1 C77.2
NetC78_1: C78.1 C79.2
NetC82_1: C82.1 L5.1 U14.6,7(SW)
NetC82_2: C82.2 U14.3(BST)
NetC83_1: C83.1 L6.1 U15.6,7(SW)
NetC83_2: C83.2 U15.3(BST)
NetC84_2: C84.2 U14.2(VCC)
NetC85_2: C85.2 U15.2(VCC)
NetC102_1: C102.1 C103.2
NetC104_1: C104.1 C105.2
NetC108_1: C108.1 L7.1 U16.6,7(SW)
NetC108_2: C108.2 U16.3(BST)
NetC109_1: C109.1 L8.1 U17.6,7(SW)
NetC109_2: C109.2 U17.3(BST)
NetC110_2: C110.2 U16.2(VCC)
NetC111_2: C111.2 U17.2(VCC)
NetR75_2: R75.2 R81.1 U14.19(EN)
NetR76_2: R76.2 R79.1 U14.13(SWEN)
NetR77_2: R77.2 R80.2 U15.13(SWEN)
NetR78_2: R78.2 R82.2 U15.19(EN)
NetR83_2: R83.2 U8.3(D1) U8.5(D2) U8.7(D3) U8.9(D4)
NetR84_1: R84.1 U8.20(*RESET/VL)
NetR85_2: R85.2 R89.1 U16.13(SWEN)
NetR86_2: R86.2 R91.1 U16.19(EN)
NetR87_2: R87.2 R90.2 U17.13(SWEN)
NetR88_2: R88.2 R92.2 U17.19(EN)

Not connected (* = marked no-connect by the designer): U8 10(D5) 11(S5) 12(D6) 13(S6) 14(D7) 15(S7) 16(D8) 17(S8)

### Notes on the sheet
- Project:
- PEE-PC1
- Sub-system:
- NANORACK_EXP_CONTROLLER
- Design by:
- SANG HUYNH
- BAO BUI Q.
- Sheet title:
- Sheet
- A3
- of
- Checked by:
- Approved by:
- VU PHAM
- Revision:
- Document No:
- V1.0.0
- Size:
- Date:

### Library data of the parts
C25 C70-C91 C93 C95-C117 C120 C121 = Capacitors: Value: 33pF
L5-L8 = L-SMD-1: partNo: 78477010; Manufacturer: Wurth Elektronik; Inductance: 1.0 μH; ComponentLink1Description: Manufacturer; ComponentLink1URL: http://www.we-online.de; Created by: Baojun Chen; Created Date: Nov.2015; ComponentLink2Description: Datasheet; ComponentLink2URL: http://katalog.we-online.de/pbs/datasheet/78477010.pdf
R75-R92 R138 = Res SMD: as R12 on sheet HEADERS_1; Published: 08/06/2000; Publisher: Altium Hobart Technology Centre
U8 = ADG1414: IC SW SPST-NOX8 11.5OHM 24LFCSP
U14-U17 = LT8722

## Sheet HEATER.SchDoc: HEATER
size 420 x 297 mm; SheetNumber: 8; SheetTotal: 12
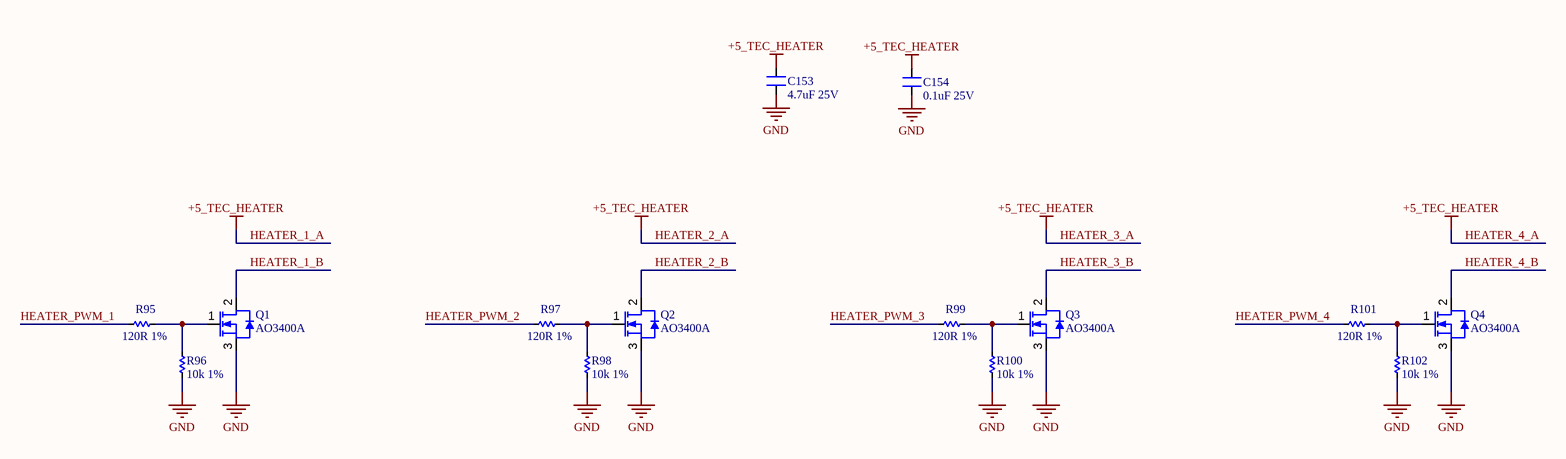
[diagram p7: HEATER.SchDoc]

### Parts
C153  4.7uF 25V  [CN-SMD-0603-EXP-V101]
C154  0.1uF 25V  [CN-SMD-0603-EXP-V101]
Q1  AO3400A  [SOT23-13_2]
Q2  AO3400A  [SOT23-13_2]
Q3  AO3400A  [SOT23-13_2]
Q4  AO3400A  [SOT23-13_2]
R95  120R 1%  [RES-SMD-0603-EXP-V101]
R96  10k 1%  [RES-SMD-0603-EXP-V101]
R97  120R 1%  [RES-SMD-0603-EXP-V101]
R98  10k 1%  [RES-SMD-0603-EXP-V101]
R99  120R 1%  [RES-SMD-0603-EXP-V101]
R100  10k 1%  [RES-SMD-0603-EXP-V101]
R101  120R 1%  [RES-SMD-0603-EXP-V101]
R102  10k 1%  [RES-SMD-0603-EXP-V101]

### Nets
GND: C153.1 C154.1 Q1.3(S) Q2.3(S) Q3.3(S) Q4.3(S) R96.1 R98.1 R100.1 R102.1
HEATER_1_A: C153.2 C154.2  [also labelled +5_TEC_HEATER, HEATER_2_A, HEATER_3_A, HEATER_4_A]
HEATER_1_B: Q1.2(D)
HEATER_2_B: Q2.2(D)
HEATER_3_B: Q3.2(D)
HEATER_4_B: Q4.2(D)
HEATER_PWM_1: R95.1
HEATER_PWM_2: R97.1
HEATER_PWM_3: R99.1
HEATER_PWM_4: R101.1
NetQ1_1: Q1.1(G) R95.2 R96.2
NetQ2_1: Q2.1(G) R97.2 R98.2
NetQ3_1: Q3.1(G) R99.2 R100.2
NetQ4_1: Q4.1(G) R101.2 R102.2

### Notes on the sheet
- Project:
- PEE-PC1
- Sub-system:
- NANORACK_EXP_CONTROLLER
- Design by:
- SANG HUYNH
- BAO BUI Q.
- Sheet title:
- Sheet
- A3
- of
- Checked by:
- Approved by:
- VU PHAM
- Revision:
- Document No:
- V1.0.0
- Size:
- Date:

### Library data of the parts
C153 C154 = Capacitors: Value: 33pF
Q1-Q4 = AO3400A: MOSFET N-CH 30V 5.7A SOT23-3L
R95-R102 = Res SMD: as R12 on sheet HEADERS_1; Published: 08/06/2000; Publisher: Altium Hobart Technology Centre

## Sheet NTC.SchDoc: NTC
size 420 x 297 mm; SheetNumber: 9; SheetTotal: 12
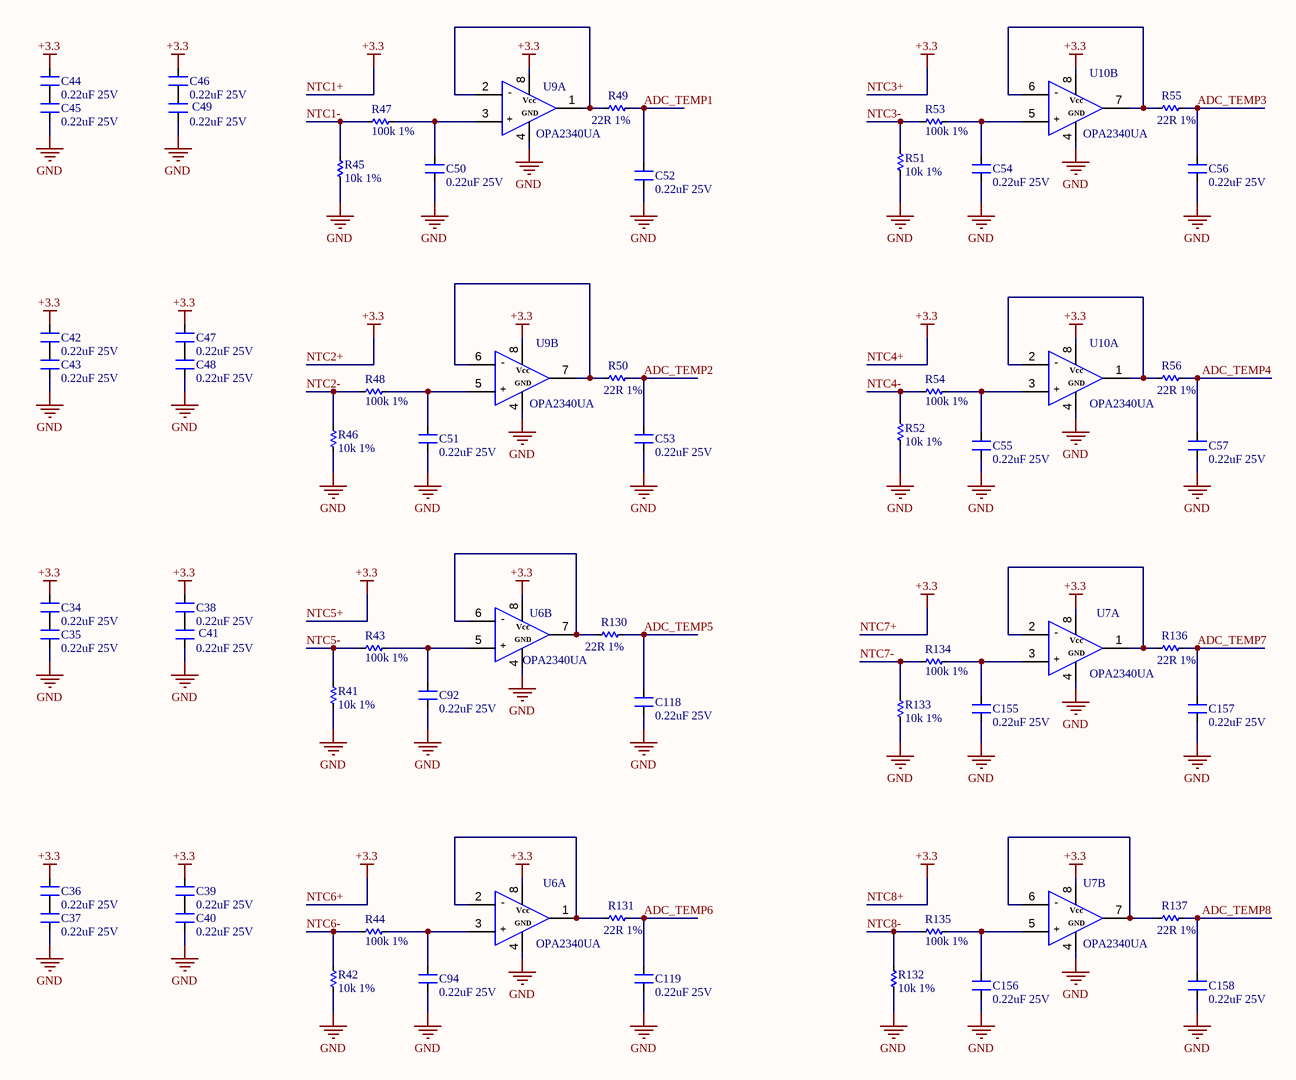
[diagram p8: NTC.SchDoc]

### Parts
C34  0.22uF 25V  [CN-SMD-0603-EXP-V101]
C35  0.22uF 25V  [CN-SMD-0603-EXP-V101]
C36  0.22uF 25V  [CN-SMD-0603-EXP-V101]
C37  0.22uF 25V  [CN-SMD-0603-EXP-V101]
C38  0.22uF 25V  [CN-SMD-0603-EXP-V101]
C39  0.22uF 25V  [CN-SMD-0603-EXP-V101]
C40  0.22uF 25V  [CN-SMD-0603-EXP-V101]
C41  0.22uF 25V  [CN-SMD-0603-EXP-V101]
C42  0.22uF 25V  [CN-SMD-0603-EXP-V101]
C43  0.22uF 25V  [CN-SMD-0603-EXP-V101]
C44  0.22uF 25V  [CN-SMD-0603-EXP-V101]
C45  0.22uF 25V  [CN-SMD-0603-EXP-V101]
C46  0.22uF 25V  [CN-SMD-0603-EXP-V101]
C47  0.22uF 25V  [CN-SMD-0603-EXP-V101]
C48  0.22uF 25V  [CN-SMD-0603-EXP-V101]
C49  0.22uF 25V  [CN-SMD-0603-EXP-V101]
C50  0.22uF 25V  [CN-SMD-0603-EXP-V101]
C51  0.22uF 25V  [CN-SMD-0603-EXP-V101]
C52  0.22uF 25V  [CN-SMD-0603-EXP-V101]
C53  0.22uF 25V  [CN-SMD-0603-EXP-V101]
C54  0.22uF 25V  [CN-SMD-0603-EXP-V101]
C55  0.22uF 25V  [CN-SMD-0603-EXP-V101]
C56  0.22uF 25V  [CN-SMD-0603-EXP-V101]
C57  0.22uF 25V  [CN-SMD-0603-EXP-V101]
C92  0.22uF 25V  [CN-SMD-0603-EXP-V101]
C94  0.22uF 25V  [CN-SMD-0603-EXP-V101]
C118  0.22uF 25V  [CN-SMD-0603-EXP-V101]
C119  0.22uF 25V  [CN-SMD-0603-EXP-V101]
C155  0.22uF 25V  [CN-SMD-0603-EXP-V101]
C156  0.22uF 25V  [CN-SMD-0603-EXP-V101]
C157  0.22uF 25V  [CN-SMD-0603-EXP-V101]
C158  0.22uF 25V  [CN-SMD-0603-EXP-V101]
R41  10k 1%  [RES-SMD-0603-EXP-V101]
R42  10k 1%  [RES-SMD-0603-EXP-V101]
R43  100k 1%  [RES-SMD-0603-EXP-V101]
R44  100k 1%  [RES-SMD-0603-EXP-V101]
R45  10k 1%  [RES-SMD-0603-EXP-V101]
R46  10k 1%  [RES-SMD-0603-EXP-V101]
R47  100k 1%  [RES-SMD-0603-EXP-V101]
R48  100k 1%  [RES-SMD-0603-EXP-V101]
R49  22R 1%  [RES-SMD-0603-EXP-V101]
R50  22R 1%  [RES-SMD-0603-EXP-V101]
R51  10k 1%  [RES-SMD-0603-EXP-V101]
R52  10k 1%  [RES-SMD-0603-EXP-V101]
R53  100k 1%  [RES-SMD-0603-EXP-V101]
R54  100k 1%  [RES-SMD-0603-EXP-V101]
R55  22R 1%  [RES-SMD-0603-EXP-V101]
R56  22R 1%  [RES-SMD-0603-EXP-V101]
R130  22R 1%  [RES-SMD-0603-EXP-V101]
R131  22R 1%  [RES-SMD-0603-EXP-V101]
R132  10k 1%  [RES-SMD-0603-EXP-V101]
R133  10k 1%  [RES-SMD-0603-EXP-V101]
R134  100k 1%  [RES-SMD-0603-EXP-V101]
R135  100k 1%  [RES-SMD-0603-EXP-V101]
R136  22R 1%  [RES-SMD-0603-EXP-V101]
R137  22R 1%  [RES-SMD-0603-EXP-V101]
U6  OPA2340UA  [SO8]  (parts A,B of 2)
U7  OPA2340UA  [SO8]  (parts A,B of 2)
U9  OPA2340UA  [SO8]  (parts A,B of 2)
U10  OPA2340UA  [SO8]  (parts A,B of 2)

### Nets
+3.3: C34.2 C36.2 C38.2 C39.2 C42.2 C44.2 C46.2 C47.2 U6.8 U7.8 U9.8 U10.8  [also labelled NTC1+, NTC2+, NTC3+, NTC4+, NTC5+, NTC6+, NTC7+, NTC8+]  [project net 3V3_EXP]
GND: C35.1 C37.1 C40.1 C41.1 C43.1 C45.1 C48.1 C49.1 C50.1 C51.1 C52.1 C53.1 C54.1 C55.1 C56.1 C57.1 C92.1 C94.1 C118.1 C119.1 C155.1 C156.1 C157.1 C158.1 R41.2 R42.2 R45.2 R46.2 R51.2 R52.2 R132.2 R133.2 U6.4 U7.4 U9.4 U10.4
ADC_TEMP1: C52.2 R49.2
ADC_TEMP2: C53.2 R50.2
ADC_TEMP3: C56.2 R55.2
ADC_TEMP4: C57.2 R56.2
ADC_TEMP5: C118.2 R130.2
ADC_TEMP6: C119.2 R131.2
ADC_TEMP7: C157.2 R136.2
ADC_TEMP8: C158.2 R137.2
NTC1-: R45.1 R47.1
NTC2-: R46.1 R48.1
NTC3-: R51.1 R53.1
NTC4-: R52.1 R54.1
NTC5-: R41.1 R43.1
NTC6-: R42.1 R44.1
NTC7-: R133.1 R134.1
NTC8-: R132.1 R135.1
NetC34_1: C34.1 C35.2
NetC36_1: C36.1 C37.2
NetC38_1: C38.1 C41.2
NetC39_1: C39.1 C40.2
NetC42_1: C42.1 C43.2
NetC44_1: C44.1 C45.2
NetC46_1: C46.1 C49.2
NetC47_1: C47.1 C48.2
NetC50_2: C50.2 R47.2 U9.3
NetC51_2: C51.2 R48.2 U9.5
NetC54_2: C54.2 R53.2 U10.5
NetC55_2: C55.2 R54.2 U10.3
NetC92_2: C92.2 R43.2 U6.5
NetC94_2: C94.2 R44.2 U6.3
NetC155_2: C155.2 R134.2 U7.3
NetC156_2: C156.2 R135.2 U7.5
NetR49_1: R49.1 U9.1 U9.2
NetR50_1: R50.1 U9.6 U9.7
NetR55_1: R55.1 U10.6 U10.7
NetR56_1: R56.1 U10.1 U10.2
NetR130_1: R130.1 U6.6 U6.7
NetR131_1: R131.1 U6.1 U6.2
NetR136_1: R136.1 U7.1 U7.2
NetR137_1: R137.1 U7.6 U7.7

### Notes on the sheet
- Project:
- PEE-PC1
- Sub-system:
- NANORACK_EXP_CONTROLLER
- Design by:
- SANG HUYNH
- BAO BUI Q.
- Sheet title:
- Sheet
- A3
- of
- Checked by:
- Approved by:
- VU PHAM
- Revision:
- Document No:
- V1.0.0
- Size:
- Date:
- (in symbol OPA2340UA/2K5, part A) -; Vcc; GND; +
- (in symbol OPA2340UA/2K5, part B) -; Vcc; GND; +

### Library data of the parts
C34-C57 C92 C94 C118 C119 C155-C158 = Capacitors: Value: 33pF
R41-R56 R130-R137 = Res SMD: as R12 on sheet HEADERS_1; Published: 08/06/2000; Publisher: Altium Hobart Technology Centre
U6 U7 U9 U10 = OPA2340UA/2K5

## Sheet I2C_SENSOR.SchDoc: I2C_SENSOR
size 420 x 297 mm; SheetNumber: 10; SheetTotal: 12
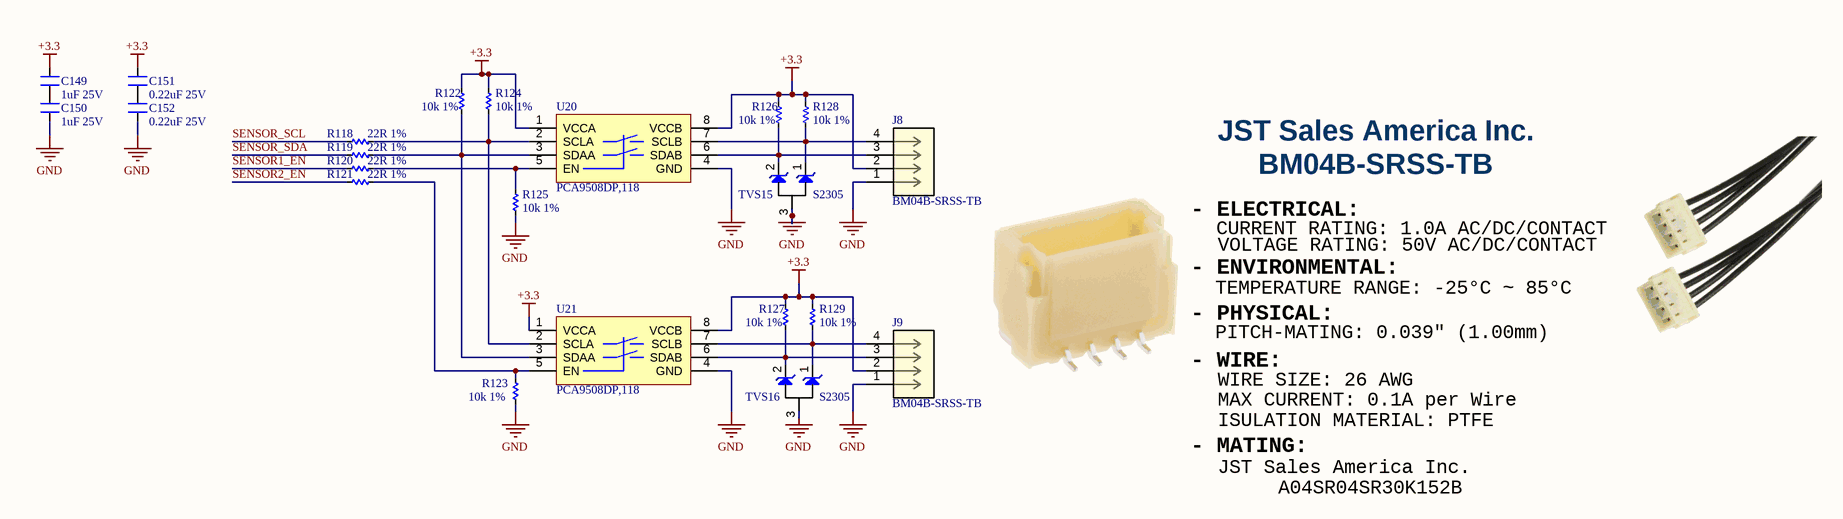
[diagram p9: I2C_SENSOR.SchDoc]

### Parts
C149  1uF 25V  [CN-SMD-0603-EXP-V101]
C150  1uF 25V  [CN-SMD-0603-EXP-V101]
C151  0.22uF 25V  [CN-SMD-0603-EXP-V101]
C152  0.22uF 25V  [CN-SMD-0603-EXP-V101]
J8  BM04B-SRSS-TB  [BM04B-SRSS-TB]
J9  BM04B-SRSS-TB  [BM04B-SRSS-TB]
R118  22R 1%  [RES-SMD-0603-EXP-V101]
R119  22R 1%  [RES-SMD-0603-EXP-V101]
R120  22R 1%  [RES-SMD-0603-EXP-V101]
R121  22R 1%  [RES-SMD-0603-EXP-V101]
R122  10k 1%  [RES-SMD-0603-EXP-V101]
R123  10k 1%  [RES-SMD-0603-EXP-V101]
R124  10k 1%  [RES-SMD-0603-EXP-V101]
R125  10k 1%  [RES-SMD-0603-EXP-V101]
R126  10k 1%  [RES-SMD-0603-EXP-V101]
R127  10k 1%  [RES-SMD-0603-EXP-V101]
R128  10k 1%  [RES-SMD-0603-EXP-V101]
R129  10k 1%  [RES-SMD-0603-EXP-V101]
TVS15  S2305  [sot23-12_3]
TVS16  S2305  [sot23-12_3]
U20  PCA9508DP,118  [TSOP8]
U21  PCA9508DP,118  [TSOP8]

### Nets
+3.3: C149.2 C151.2 J8.2 J9.2 R122.1 R124.1 R126.1 R127.1 R128.1 R129.1 U20.1(VCCA) U20.8(VCCB) U21.1(VCCA) U21.8(VCCB)  [project net 3V3_EXP]
GND: C150.1 C152.1 J8.1 J9.1 R123.2 R125.2 TVS15.3 TVS16.3 U20.4(GND) U21.4(GND)
SENSOR1_EN: R120.1
SENSOR2_EN: R121.1
SENSOR_SCL: R118.1
SENSOR_SDA: R119.1
NetC149_1: C149.1 C150.2
NetC151_1: C151.1 C152.2
NetJ8_3: J8.3 R126.2 TVS15.2 U20.6(SDAB)
NetJ8_4: J8.4 R128.2 TVS15.1 U20.7(SCLB)
NetJ9_3: J9.3 R127.2 TVS16.2 U21.6(SDAB)
NetJ9_4: J9.4 R129.2 TVS16.1 U21.7(SCLB)
NetR118_2: R118.2 R124.2 U20.2(SCLA) U21.2(SCLA)
NetR119_2: R119.2 R122.2 U20.3(SDAA) U21.3(SDAA)
NetR120_2: R120.2 R125.1 U20.5(EN)
NetR121_2: R121.2 R123.1 U21.5(EN)

### Notes on the sheet
- JST Sales America Inc.
- BM04B-SRSS-TB
- - ELECTRICAL:
- CURRENT RATING: 1.0A AC/DC/CONTACT
- VOLTAGE RATING: 50V AC/DC/CONTACT
- - ENVIRONMENTAL:
- - PHYSICAL:
- TEMPERATURE RANGE: -25°C ~ 85°C
- - WIRE:
- PITCH-MATING: 0.039" (1.00mm)
- WIRE SIZE: 26 AWG
- - MATING:
- MAX CURRENT: 0.1A per Wire
- ISULATION MATERIAL: PTFE
- A04SR04SR30K152B
- Project:
- PEE-PC1
- Sub-system:
- NANORACK_EXP_CONTROLLER
- Design by:
- SANG HUYNH
- BAO BUI Q.
- Sheet title:
- Sheet
- A3
- of
- Checked by:
- Approved by:
- VU PHAM
- Revision:
- Document No:
- V1.0.0
- Size:
- Date:

### Library data of the parts
C149-C152 = Capacitors: Value: 33pF
J8 J9 = BM04B-SRSS-TB: CONN HEADER SMD 4POS 1MM
R118-R129 = Res SMD: as R12 on sheet HEADERS_1; Published: 08/06/2000; Publisher: Altium Hobart Technology Centre
TVS15 TVS16 = S2305: TVS DIODE 5VWM 10.8VC SOT23

## Sheet LED.SchDoc: LED
size 420 x 297 mm; SheetNumber: 11; SheetTotal: 12
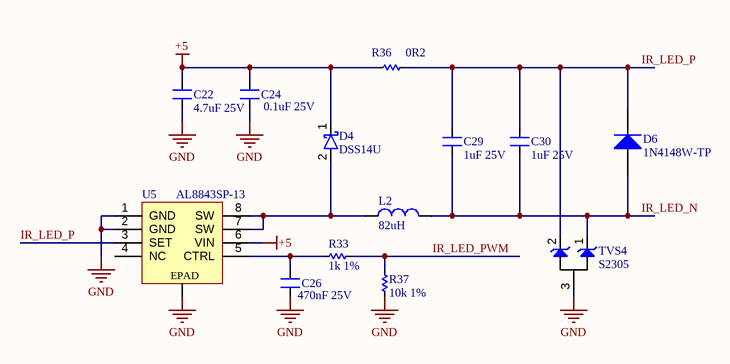
[diagram p10: LED.SchDoc]

### Parts
C22  4.7uF 25V  [CN-SMD-0603-EXP-V101]
C24  0.1uF 25V  [CN-SMD-0603-EXP-V101]
C26  470nF 25V  [CN-SMD-0603-EXP-V101]
C29  1uF 25V  [CN-SMD-0603-EXP-V101]
C30  1uF 25V  [CN-SMD-0603-EXP-V101]
D4  DSS14U  [SOD-123-EXP-V101]
D6  1N4148W-TP  [SOD-123-EXP-V101]
L2  82uH  [L-SMD-M-4.8x4.8x2.8mm]
R33  1k 1%  [RES-SMD-0603-EXP-V101]
R36  0R2  [RES-SMD-1206-EXP-V101]
R37  10k 1%  [RES-SMD-0603-EXP-V101]
TVS4  S2305  [sot23-12_3]
U5  AL8843SP-13  [SO8_EPAD]

### Nets
+5: C22.2 C24.2 D4.1 R36.2 U5.6(VIN)
GND: C22.1 C24.1 C26.1 R37.1 TVS4.3 U5.1(GND) U5.2(GND) U5.EPAD
IR_LED_N: C29.1 C30.1 D6.2(A) L2.2 TVS4.1
IR_LED_P: C29.2 C30.2 D6.1(K) R36.1 TVS4.2 U5.3(SET)
IR_LED_PWM: R33.2 R37.2
NetC26_2: C26.2 R33.1 U5.5(CTRL)
NetD4_2: D4.2 L2.1 U5.7(SW) U5.8(SW)

Not connected (* = marked no-connect by the designer): U5 4(NC)

### Notes on the sheet
- Project:
- PEE-PC1
- Sub-system:
- NANORACK_EXP_CONTROLLER
- Design by:
- SANG HUYNH
- BAO BUI Q.
- Sheet title:
- Sheet
- A3
- of
- Checked by:
- Approved by:
- VU PHAM
- Revision:
- Document No:
- V1.0.0
- Size:
- Date:

### Library data of the parts
C22 C24 C26 C29 C30 = Capacitors: Value: 33pF
D6 = 1N4148W-TP: DIODE GEN PURP 100V 300MA SOD123; MPN: 1N4148W-7-F; MFR: Diodes Incorporated; Solder: SMT; Value: 100V/300MA
L2 = L-SMD-1: SRR4828A-820M; partNo: 78477010; Manufacturer: Wurth Elektronik; Inductance: 1.0 μH; ComponentLink1Description: Manufacturer; ComponentLink1URL: http://www.we-online.de; Created by: Baojun Chen; Created Date: Nov.2015; ComponentLink2Description: Datasheet; ComponentLink2URL: http://katalog.we-online.de/pbs/datasheet/78477010.pdf
R33 R37 = Res SMD: as R12 on sheet HEADERS_1; Published: 08/06/2000; Publisher: Altium Hobart Technology Centre
R36 = Res-SMD: RES 0.1 OHM 1% 1W 1206 / PN: PE1206FRF470R1L; Manufacturer: Generic Components; Class: Passive; Published: 08/06/2000; Publisher: Altium Hobart Technology Centre
TVS4 = S2305: TVS DIODE 5VWM 10.8VC SOT23
U5 = AL8843SP-13: IC LED DRIVER RGLTR PWM 3A 8SO

## Sheet MCU.SchDoc: MCU
size 420 x 297 mm; SheetNumber: 12; SheetTotal: 12
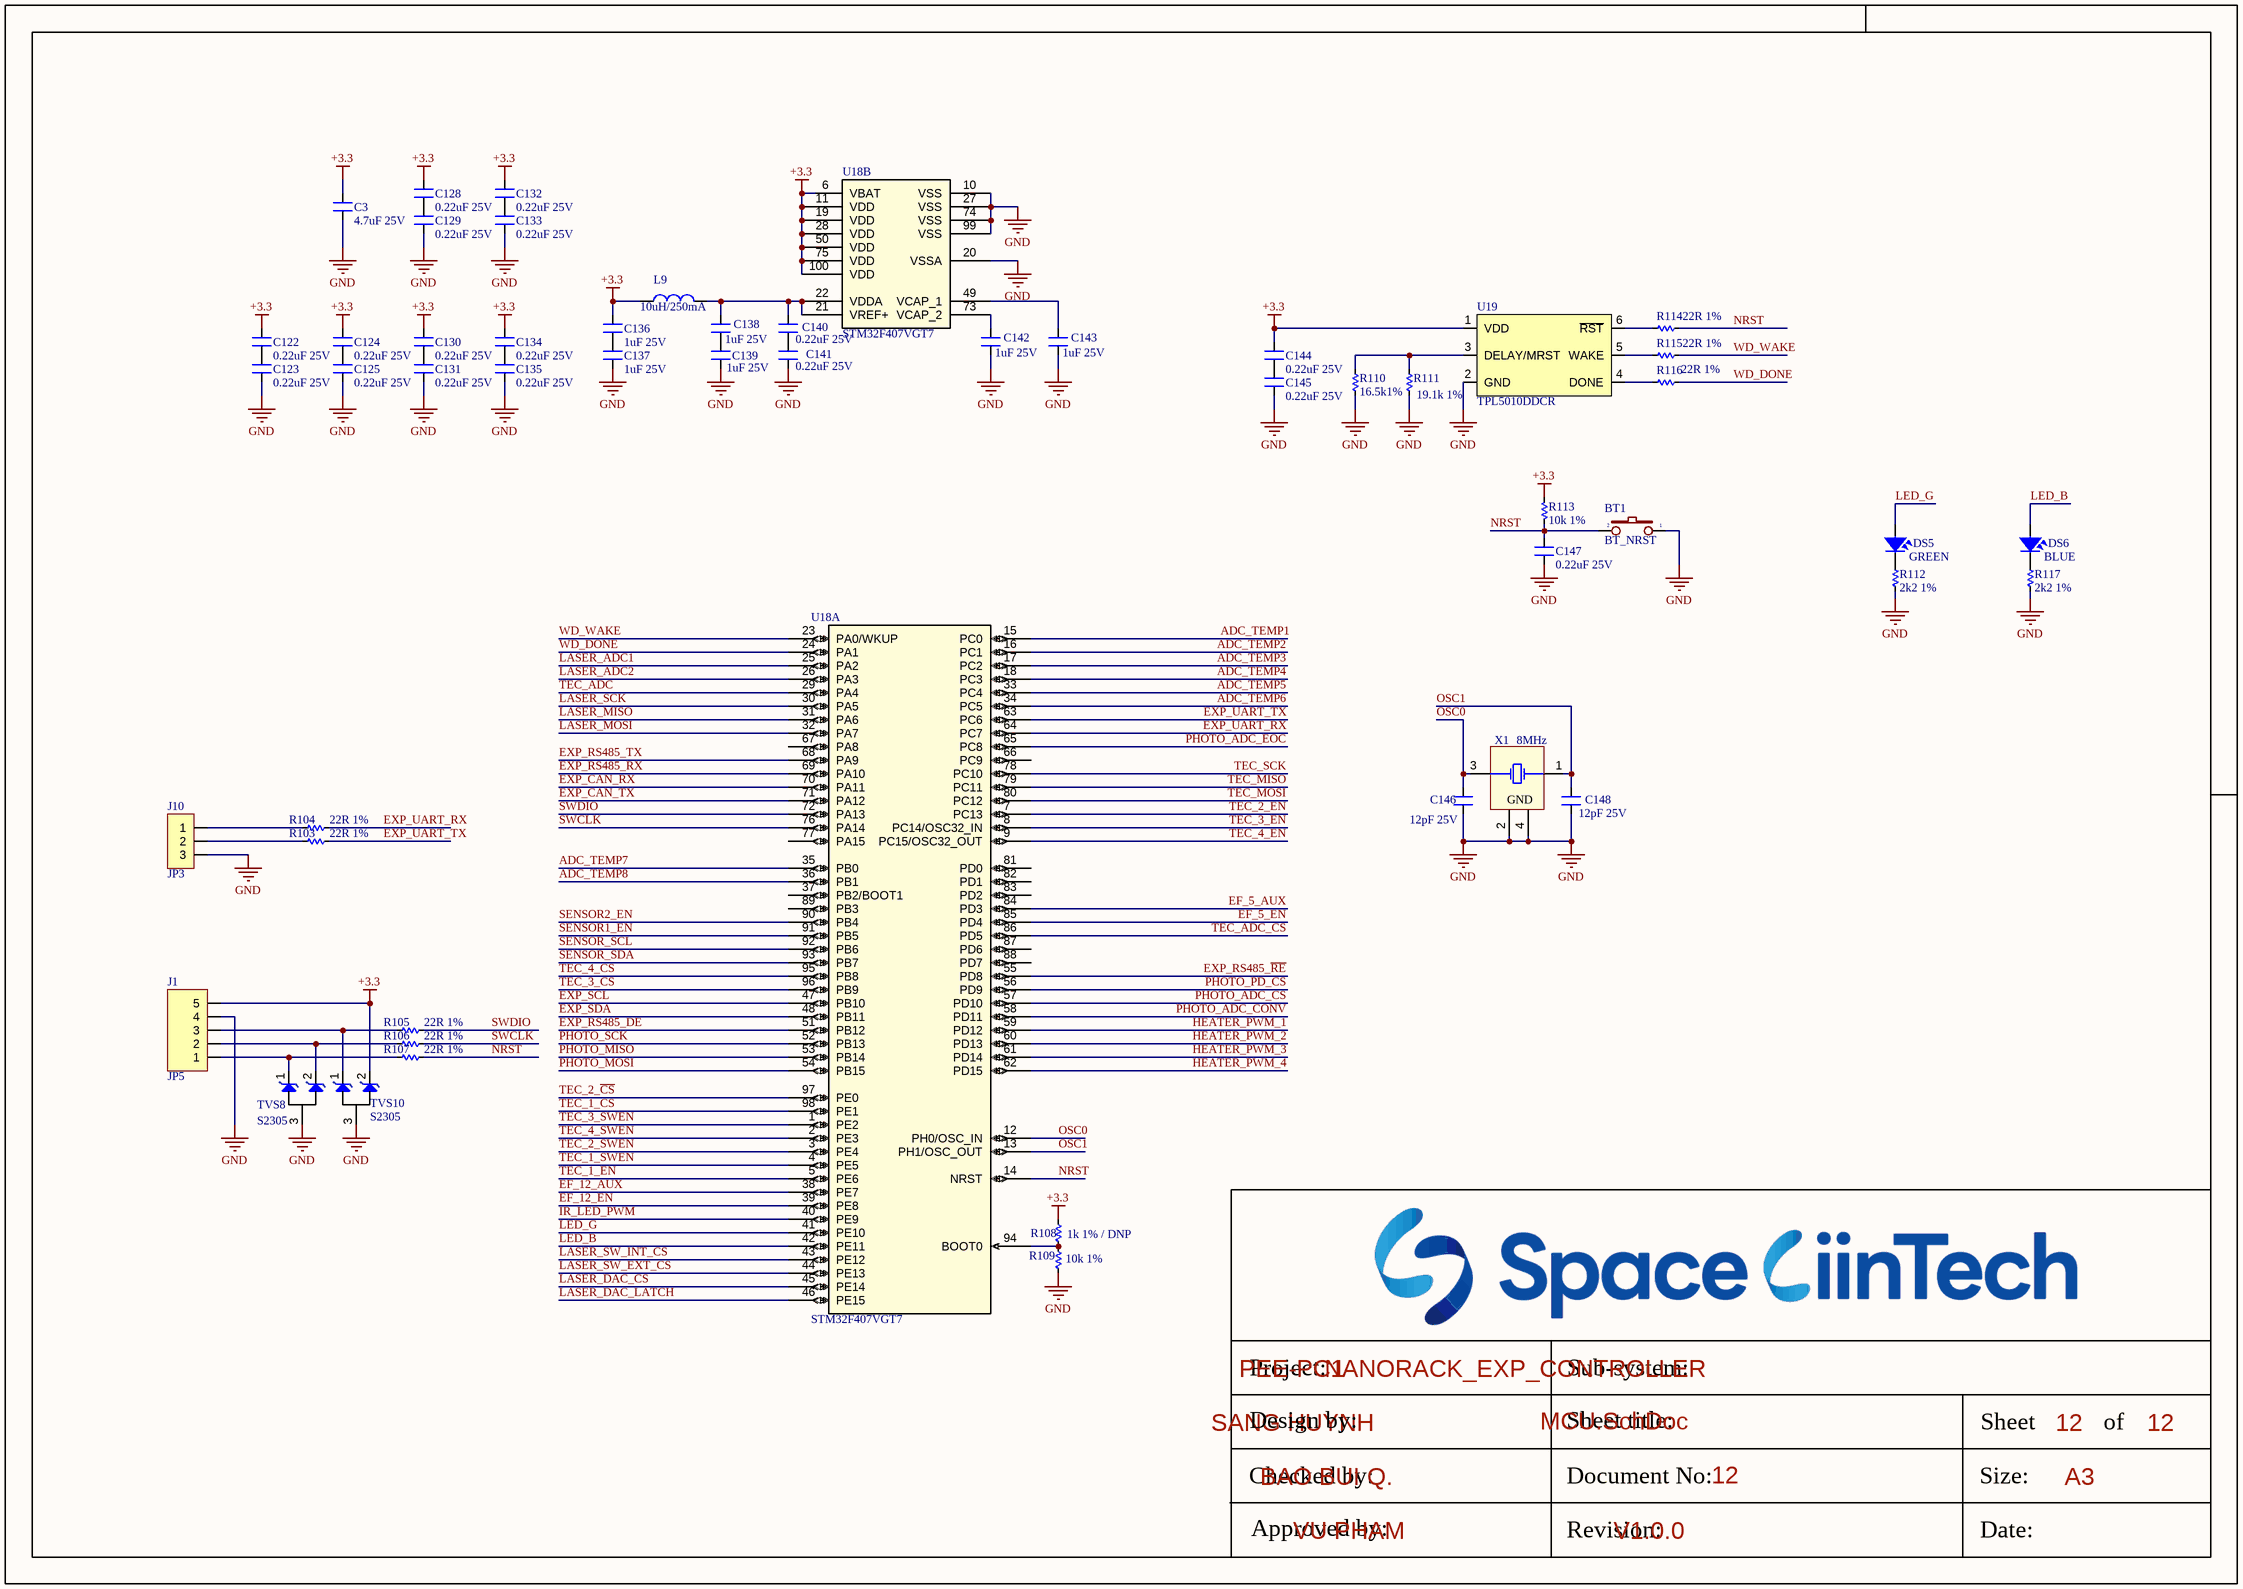
[diagram p11: MCU.SchDoc]

### Parts
BT1  BT_NRST  [SW1-SMD]
C3  4.7uF 25V  [CN-SMD-0603-EXP-V101]
C122  0.22uF 25V  [CN-SMD-0603-EXP-V101]
C123  0.22uF 25V  [CN-SMD-0603-EXP-V101]
C124  0.22uF 25V  [CN-SMD-0603-EXP-V101]
C125  0.22uF 25V  [CN-SMD-0603-EXP-V101]
C128  0.22uF 25V  [CN-SMD-0603-EXP-V101]
C129  0.22uF 25V  [CN-SMD-0603-EXP-V101]
C130  0.22uF 25V  [CN-SMD-0603-EXP-V101]
C131  0.22uF 25V  [CN-SMD-0603-EXP-V101]
C132  0.22uF 25V  [CN-SMD-0603-EXP-V101]
C133  0.22uF 25V  [CN-SMD-0603-EXP-V101]
C134  0.22uF 25V  [CN-SMD-0603-EXP-V101]
C135  0.22uF 25V  [CN-SMD-0603-EXP-V101]
C136  1uF 25V  [CN-SMD-0603-EXP-V101]
C137  1uF 25V  [CN-SMD-0603-EXP-V101]
C138  1uF 25V  [CN-SMD-0603-EXP-V101]
C139  1uF 25V  [CN-SMD-0603-EXP-V101]
C140  0.22uF 25V  [CN-SMD-0603-EXP-V101]
C141  0.22uF 25V  [CN-SMD-0603-EXP-V101]
C142  1uF 25V  [CN-SMD-0603-EXP-V101]
C143  1uF 25V  [CN-SMD-0603-EXP-V101]
C144  0.22uF 25V  [CN-SMD-0603-EXP-V101]
C145  0.22uF 25V  [CN-SMD-0603-EXP-V101]
C146  12pF 25V  [CN-SMD-0603-EXP-V101]
C147  0.22uF 25V  [CN-SMD-0603-EXP-V101]
C148  12pF 25V  [CN-SMD-0603-EXP-V101]
DS5  GREEN  [LED-0603-BLUE-EXP-V01]
DS6  BLUE  [LED-0603-BLUE-EXP-V01]
J1  JP5  [JP5-D1C]
J10  JP3  [JP3-D1C]
L9  10uH/250mA  [L-SMD-0603-EXP-V101]
R103  22R 1%  [RES-SMD-0603-EXP-V101]
R104  22R 1%  [RES-SMD-0603-EXP-V101]
R105  22R 1%  [RES-SMD-0603-EXP-V101]
R106  22R 1%  [RES-SMD-0603-EXP-V101]
R107  22R 1%  [RES-SMD-0603-EXP-V101]
R108  1k 1% / DNP  [RES-SMD-0603-EXP-V101]
R109  10k 1%  [RES-SMD-0603-EXP-V101]
R110  16.5k1%  [RES-SMD-0603-EXP-V101]
R111  19.1k 1%  [RES-SMD-0603-EXP-V101]
R112  2k2 1%  [RES-SMD-0603-EXP-V101]
R113  10k 1%  [RES-SMD-0603-EXP-V101]
R114  22R 1%  [RES-SMD-0603-EXP-V101]
R115  22R 1%  [RES-SMD-0603-EXP-V101]
R116  22R 1%  [RES-SMD-0603-EXP-V101]
R117  2k2 1%  [RES-SMD-0603-EXP-V101]
TVS8  S2305  [sot23-12_3]
TVS10  S2305  [sot23-12_3]
U18  STM32F407VGT7  [LQFP-100-EXP-v101]  (parts A,B of 2)
U19  TPL5010DDCR  [SOT23-6-123_456]
X1  8MHz  [XT4-16.000MHz-4_V]

### Nets
+3.3: C3.2 C122.2 C124.2 C128.2 C130.2 C132.2 C134.2 C136.2 C144.2 J1.5 L9.1 R108.1 R113.1 TVS10.2 U18.6(VBAT) U18.11(VDD) U18.19(VDD) U18.28(VDD) U18.50(VDD) U18.75(VDD) U18.100(VDD) U19.1(VDD)  [project net 3V3_EXP]
GND: BT1.1 C3.1 C123.1 C125.1 C129.1 C131.1 C133.1 C135.1 C137.1 C139.1 C141.1 C142.1 C143.1 C145.1 C146.2 C147.1 C148.1 J1.4 J10.3 R109.2 R110.1 R111.1 R112.2 R117.2 TVS8.3 TVS10.3 U18.10(VSS) U18.20(VSSA) U18.27(VSS) U18.74(VSS) U18.99(VSS) U19.2(GND) X1.2(GND) X1.4(GND)
ADC_TEMP1: U18.15(PC0)
ADC_TEMP2: U18.16(PC1)
ADC_TEMP3: U18.17(PC2)
ADC_TEMP4: U18.18(PC3)
ADC_TEMP5: U18.33(PC4)
ADC_TEMP6: U18.34(PC5)
ADC_TEMP7: U18.35(PB0)
ADC_TEMP8: U18.36(PB1)
EF_5_AUX: U18.84(PD3)
EF_5_EN: U18.85(PD4)
EF_12_AUX: U18.38(PE7)
EF_12_EN: U18.39(PE8)
EXP_CAN_RX: U18.70(PA11)
EXP_CAN_TX: U18.71(PA12)
EXP_RS485_DE: U18.51(PB12)
EXP_RS485_~{RE}: U18.55(PD8)
EXP_RS485_RX: U18.69(PA10)
EXP_RS485_TX: U18.68(PA9)
EXP_SCL: U18.47(PB10)
EXP_SDA: U18.48(PB11)
EXP_UART_RX: R104.1 U18.64(PC7)
EXP_UART_TX: R103.1 U18.63(PC6)
HEATER_PWM_1: U18.59(PD12)
HEATER_PWM_2: U18.60(PD13)
HEATER_PWM_3: U18.61(PD14)
HEATER_PWM_4: U18.62(PD15)
IR_LED_PWM: U18.40(PE9)
LASER_ADC1: U18.25(PA2)
LASER_ADC2: U18.26(PA3)
LASER_DAC_CS: U18.45(PE14)
LASER_DAC_LATCH: U18.46(PE15)
LASER_MISO: U18.31(PA6)
LASER_MOSI: U18.32(PA7)
LASER_SCK: U18.30(PA5)
LASER_SW_EXT_CS: U18.44(PE13)
LASER_SW_INT_CS: U18.43(PE12)
LED_B: DS6.1 U18.42(PE11)
LED_G: DS5.1 U18.41(PE10)
NRST: BT1.2 C147.2 R107.1 R113.2 R114.2 U18.14(NRST)
OSC0: C146.1 U18.12(PH0/OSC_IN) X1.3(XTAL)
OSC1: C148.2 U18.13(PH1/OSC_OUT) X1.1(XTAL)
PHOTO_ADC_CONV: U18.58(PD11)
PHOTO_ADC_CS: U18.57(PD10)
PHOTO_ADC_EOC: U18.65(PC8)
PHOTO_MISO: U18.53(PB14)
PHOTO_MOSI: U18.54(PB15)
PHOTO_PD_CS: U18.56(PD9)
PHOTO_SCK: U18.52(PB13)
SENSOR1_EN: U18.91(PB5)
SENSOR2_EN: U18.90(PB4)
SENSOR_SCL: U18.92(PB6)
SENSOR_SDA: U18.93(PB7)
SWCLK: R106.1 U18.76(PA14)
SWDIO: R105.1 U18.72(PA13)
TEC_1_~{CS}: U18.98(PE1)
TEC_1_EN: U18.5(PE6)
TEC_1_SWEN: U18.4(PE5)
TEC_2_~{CS}: U18.97(PE0)
TEC_2_EN: U18.7(PC13)
TEC_2_SWEN: U18.3(PE4)
TEC_3_~{CS}: U18.96(PB9)
TEC_3_EN: U18.8(PC14/OSC32_IN)
TEC_3_SWEN: U18.1(PE2)
TEC_4_~{CS}: U18.95(PB8)
TEC_4_EN: U18.9(PC15/OSC32_OUT)
TEC_4_SWEN: U18.2(PE3)
TEC_ADC: U18.29(PA4)
TEC_ADC_~{CS}: U18.86(PD5)
TEC_MISO: U18.79(PC11)
TEC_MOSI: U18.80(PC12)
TEC_SCK: U18.78(PC10)
WD_DONE: R116.2 U18.24(PA1)
WD_WAKE: R115.2 U18.23(PA0/WKUP)
NetC122_1: C122.1 C123.2
NetC124_1: C124.1 C125.2
NetC128_1: C128.1 C129.2
NetC130_1: C130.1 C131.2
NetC132_1: C132.1 C133.2
NetC134_1: C134.1 C135.2
NetC136_1: C136.1 C137.2
NetC138_1: C138.1 C139.2
NetC138_2: C138.2 C140.2 L9.2 U18.21(VREF+) U18.22(VDDA)
NetC140_1: C140.1 C141.2
NetC142_2: C142.2 U18.73(VCAP_2)
NetC143_2: C143.2 U18.49(VCAP_1)
NetC144_1: C144.1 C145.2
NetDS5_2: DS5.2 R112.1
NetDS6_2: DS6.2 R117.1
NetJ1_1: J1.1 R107.2 TVS8.1
NetJ1_2: J1.2 R106.2 TVS8.2
NetJ1_3: J1.3 R105.2 TVS10.1
NetJ10_1: J10.1 R104.2
NetJ10_2: J10.2 R103.2
NetR108_2: R108.2 R109.1 U18.94(BOOT0)
NetR110_2: R110.2 R111.2 U19.3(DELAY/MRST)
NetR114_1: R114.1 U19.6(~{RST})
NetR115_1: R115.1 U19.5(WAKE)
NetR116_1: R116.1 U19.4(DONE)

Not connected (* = marked no-connect by the designer): U18 37(PB2/BOOT1) 66(PC9) 67(PA8) 77(PA15) 81(PD0) 82(PD1) 83(PD2) 87(PD6) 88(PD7) 89(PB3)

### Notes on the sheet
- Project:
- PEE-PC1
- Sub-system:
- NANORACK_EXP_CONTROLLER
- Design by:
- SANG HUYNH
- BAO BUI Q.
- Sheet title:
- Sheet
- A3
- of
- Checked by:
- Approved by:
- VU PHAM
- Revision:
- Document No:
- V1.0.0
- Size:
- Date:

### Library data of the parts
BT1 = SW2: Switch button 2 pin; Value: SW chip 2 pin
C3 C122-C125 C128-C148 = Capacitors: Value: 33pF
DS5 DS6 = LED SMD: Value: LED 3 - 5 ly 2 Colour
J1 = JP5: WR-PHD 2.54 mm Angled Socket Header; Manufacturer: W¨¹rth Elektronik eiSos GmbH; partNo: 613005143121; ComponentLink1 Description: Manufacturer; ComponentLink2 Description: Datasheet; NoPins: 05; Created Date: 29 March 2013; ComponentLink1URL: http://www.we-online.com; ComponentLink2URL: http://katalog.we-online.de/em/datasheet/6130xx143121.pdf; Created by: Karrer Zheng
J10 = JP3: WR-PHD 2.54 mm Angled Socket Header; Manufacturer: W¨¹rth Elektronik eiSos GmbH; partNo: 613003143121; ComponentLink1 Description: Manufacturer; ComponentLink2 Description: Datasheet; NoPins: 03; Created Date: 29 March 2013; ComponentLink1URL: http://www.we-online.com; ComponentLink2URL: http://katalog.we-online.de/em/datasheet/6130xx143121.pdf; Created by: Karrer Zheng
L9 = L-SMD-1: as L5 on sheet TECS_DRIVER; ComponentLink1Description: Manufacturer; ComponentLink1URL: http://www.we-online.de; Created by: Baojun Chen; Created Date: Nov.2015; ComponentLink2Description: Datasheet; ComponentLink2URL: http://katalog.we-online.de/pbs/datasheet/78477010.pdf
R103-R117 = Res SMD: as R12 on sheet HEADERS_1; Published: 08/06/2000; Publisher: Altium Hobart Technology Centre
TVS8 TVS10 = S2305: TVS DIODE 5VWM 10.8VC SOT23
U18 = STM32F407VGT7: ARM® Cortex®-M4 STM32F4 Microcontroller IC 32-Bit Single-Core 168MHz 1MB (1M x 8) FLASH 100-LQFP (14x14)
U19 = TPL5010DDCR: IC OSC PROG TIMER TSOT23-6
X1 = XT4: Crystal, 8 MHz, -30 to 85 degC, 3.2 x 2.5 x 0.9 mm SMD; Value: 4Mhz

## Nets that join several sheets
3V3_EXP: HEADERS_2 (8 pins), POWERchDoc (7 pins), ISO_COM (11 pins), TECS_DRIVER (10 pins), NTC (12 pins), I2C_SENSOR (14 pins), MCU (22 pins)
12_EXP: HEADERS_1 (5 pins), POWERchDoc (7 pins)
+5: POWERchDoc (16 pins), LED (5 pins)
+12: POWERchDoc (9 pins), TECS_DRIVER (U8.23)
GND: HEADERS_1 (9 pins), HEADERS_2 (J2.S1 J2.S2), POWERchDoc (43 pins), ISO_COM (7 pins), TECS_DRIVER (56 pins), HEATER (10 pins), NTC (36 pins), I2C_SENSOR (10 pins), LED (8 pins), MCU (34 pins)
GND_BUS: HEADERS_1 (5 pins), ISO_COM (6 pins)
HEATER_1_A: HEADERS_2 (J3.10 J3.12 J3.14 J3.16), POWERchDoc (5 pins), TECS_DRIVER (20 pins), HEATER (C153.2 C154.2)
VBUS: HEADERS_1 (J4.11), ISO_COM (8 pins)
ADC_TEMP1: NTC (C52.2 R49.2), MCU (U18.15)
ADC_TEMP2: NTC (C53.2 R50.2), MCU (U18.16)
ADC_TEMP3: NTC (C56.2 R55.2), MCU (U18.17)
ADC_TEMP4: NTC (C57.2 R56.2), MCU (U18.18)
ADC_TEMP5: NTC (C118.2 R130.2), MCU (U18.33)
ADC_TEMP6: NTC (C119.2 R131.2), MCU (U18.34)
ADC_TEMP7: NTC (C157.2 R136.2), MCU (U18.35)
ADC_TEMP8: NTC (C158.2 R137.2), MCU (U18.36)
EF_5_AUX: POWERchDoc (R28.2), MCU (U18.84)
EF_5_EN: POWERchDoc (R3.1), MCU (U18.85)
EF_12_AUX: POWERchDoc (R27.2), MCU (U18.38)
EF_12_EN: POWERchDoc (R1.1), MCU (U18.39)
EXP_CAN_RX: ISO_COM (R63.2), MCU (U18.70)
EXP_CAN_TX: ISO_COM (R62.2), MCU (U18.71)
EXP_RS485_DE: ISO_COM (R67.2), MCU (U18.51)
EXP_RS485_~{RE}: ISO_COM (R66.2), MCU (U18.55)
EXP_RS485_RX: ISO_COM (R74.2), MCU (U18.69)
EXP_RS485_TX: ISO_COM (R72.2), MCU (U18.68)
EXP_SCL: ISO_COM (R70.2), MCU (U18.47)
EXP_SDA: ISO_COM (R69.2), MCU (U18.48)
HEATER_1_B: HEADERS_2 (J3.9), HEATER (Q1.2)
HEATER_2_B: HEADERS_2 (J3.11), HEATER (Q2.2)
HEATER_3_B: HEADERS_2 (J3.13), HEATER (Q3.2)
HEATER_4_B: HEADERS_2 (J3.15), HEATER (Q4.2)
HEATER_PWM_1: HEATER (R95.1), MCU (U18.59)
HEATER_PWM_2: HEATER (R97.1), MCU (U18.60)
HEATER_PWM_3: HEATER (R99.1), MCU (U18.61)
HEATER_PWM_4: HEATER (R101.1), MCU (U18.62)
IR_LED_N: HEADERS_2 (J2.1), LED (5 pins)
IR_LED_P: HEADERS_2 (J2.2), LED (6 pins)
IR_LED_PWM: LED (R33.2 R37.2), MCU (U18.40)
ISO_CANH: HEADERS_1 (J4.6), ISO_COM (U13.7)
ISO_CANL: HEADERS_1 (J4.4), ISO_COM (U13.6)
ISO_RS485_R+: HEADERS_1 (J4.33), ISO_COM (R59.2 U12.14)
ISO_RS485_R-: HEADERS_1 (J4.31), ISO_COM (R59.1 U12.13)
ISO_RS485_T+: HEADERS_1 (J4.34), ISO_COM (R60.1 U12.11)
ISO_RS485_T-: HEADERS_1 (J4.32), ISO_COM (R60.2 U12.12)
ISO_SCL0: HEADERS_1 (J4.8), ISO_COM (R57.1 U11.3)
ISO_SDA0: HEADERS_1 (J4.10), ISO_COM (R58.1 U11.2)
LASER_ADC1: HEADERS_1 (C32.2 R16.2), MCU (U18.25)
LASER_ADC2: HEADERS_1 (C33.2 R17.2), MCU (U18.26)
LASER_DAC_CS: HEADERS_1 (R39.1), MCU (U18.45)
LASER_DAC_LATCH: HEADERS_1 (R40.1), MCU (U18.46)
LASER_MISO: HEADERS_1 (R14.2), MCU (U18.31)
LASER_MOSI: HEADERS_1 (R15.2), MCU (U18.32)
LASER_SCK: HEADERS_1 (R12.2), MCU (U18.30)
LASER_SW_EXT_CS: HEADERS_1 (R38.1), MCU (U18.44)
LASER_SW_INT_CS: HEADERS_1 (R35.1), MCU (U18.43)
NTC1-: HEADERS_2 (J7.2), NTC (R45.1 R47.1)
NTC2-: HEADERS_2 (J7.4), NTC (R46.1 R48.1)
NTC3-: HEADERS_2 (J7.6), NTC (R51.1 R53.1)
NTC4-: HEADERS_2 (J7.8), NTC (R52.1 R54.1)
NTC5-: HEADERS_2 (J7.10), NTC (R41.1 R43.1)
NTC6-: HEADERS_2 (J7.12), NTC (R42.1 R44.1)
NTC7-: HEADERS_2 (J7.14), NTC (R133.1 R134.1)
NTC8-: HEADERS_2 (J7.16), NTC (R132.1 R135.1)
PHOTO_ADC_CONV: HEADERS_1 (R32.2), MCU (U18.58)
PHOTO_ADC_CS: HEADERS_1 (R26.2), MCU (U18.57)
PHOTO_ADC_EOC: HEADERS_1 (R34.2), MCU (U18.65)
PHOTO_MISO: HEADERS_1 (R22.2), MCU (U18.53)
PHOTO_MOSI: HEADERS_1 (R19.2), MCU (U18.54)
PHOTO_PD_CS: HEADERS_1 (R25.2), MCU (U18.56)
PHOTO_SCK: HEADERS_1 (R18.2), MCU (U18.52)
SENSOR1_EN: I2C_SENSOR (R120.1), MCU (U18.91)
SENSOR2_EN: I2C_SENSOR (R121.1), MCU (U18.90)
SENSOR_SCL: I2C_SENSOR (R118.1), MCU (U18.92)
SENSOR_SDA: I2C_SENSOR (R119.1), MCU (U18.93)
TEC_1_A: HEADERS_2 (J3.1), TECS_DRIVER (C86.2 C88.2 C95.2 U14.8,9)
TEC_1_B: HEADERS_2 (J3.2), TECS_DRIVER (C90.2 C95.1 L5.2 U14.12)
TEC_1_~{CS}: TECS_DRIVER (U14.15), MCU (U18.98)
TEC_1_EN: TECS_DRIVER (R75.1), MCU (U18.5)
TEC_1_SWEN: TECS_DRIVER (R76.1), MCU (U18.4)
TEC_2_A: HEADERS_2 (J3.3), TECS_DRIVER (C112.2 C114.2 C120.2 U16.8,9)
TEC_2_B: HEADERS_2 (J3.4), TECS_DRIVER (C116.2 C120.1 L7.2 U16.12)
TEC_2_~{CS}: TECS_DRIVER (U16.15), MCU (U18.97)
TEC_2_EN: TECS_DRIVER (R86.1), MCU (U18.7)
TEC_2_SWEN: TECS_DRIVER (R85.1), MCU (U18.3)
TEC_3_A: HEADERS_2 (J3.5), TECS_DRIVER (C87.2 C89.2 C93.2 U15.8,9)
TEC_3_B: HEADERS_2 (J3.6), TECS_DRIVER (C91.2 C93.1 L6.2 U15.12)
TEC_3_~{CS}: TECS_DRIVER (U15.15), MCU (U18.96)
TEC_3_EN: TECS_DRIVER (R78.1), MCU (U18.8)
TEC_3_SWEN: TECS_DRIVER (R77.1), MCU (U18.1)
TEC_4_A: HEADERS_2 (J3.7), TECS_DRIVER (C113.2 C115.2 C121.2 U17.8,9)
TEC_4_B: HEADERS_2 (J3.8), TECS_DRIVER (C117.2 C121.1 L8.2 U17.12)
TEC_4_~{CS}: TECS_DRIVER (U17.15), MCU (U18.95)
TEC_4_EN: TECS_DRIVER (R88.1), MCU (U18.9)
TEC_4_SWEN: TECS_DRIVER (R87.1), MCU (U18.2)
TEC_ADC: TECS_DRIVER (C25.2 R83.1), MCU (U18.29)
TEC_ADC_~{CS}: TECS_DRIVER (U8.21), MCU (U18.86)
TEC_MISO: TECS_DRIVER (6 pins), MCU (U18.79)
TEC_MOSI: TECS_DRIVER (5 pins), MCU (U18.80)
TEC_SCK: TECS_DRIVER (5 pins), MCU (U18.78)